# Altium project GECKO3.PRJPCB (part 3 of 4)

## Sheet jtag.SchDoc: JTAG and RS232 Connector
size A4; Organization: Berne University of Applied Science; Address1: School of Engineering and; Address2: Information Technology; Address3: Quellgasse 21; Address4: CH-2501 Biel; Revision: 1.0; SheetNumber: 17; SheetTotal: 19; ApprovedBy: zem1; Author: zac1
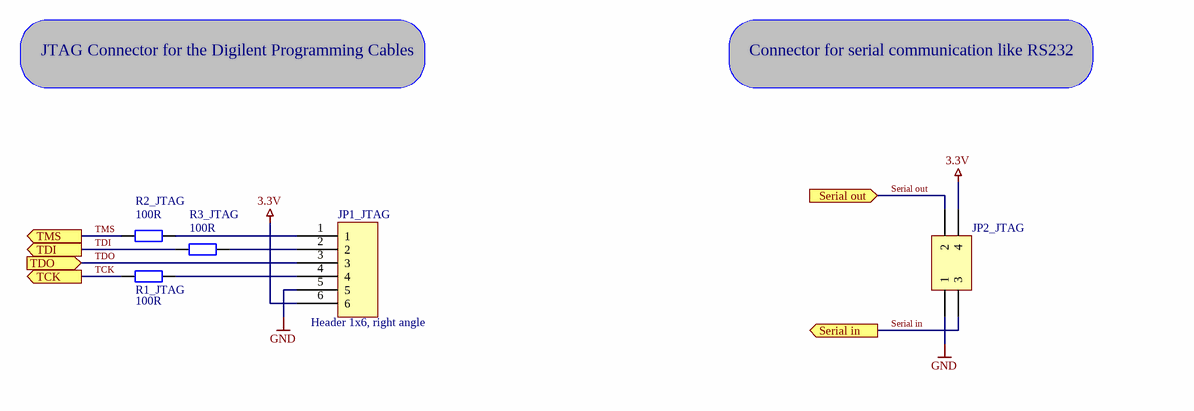
[diagram p8: jtag.SchDoc]

### Parts
JP1_JTAG  value Header 1x6, right angle  [HDR1X6H-90°]  (hidden comment: Header 6H)
JP2_JTAG  M22-2040205  [M22-2040205]  (value not drawn)
R1_JTAG  value 100R  [0402]  (hidden comment: Res2)
R2_JTAG  value 100R  [0402]  (hidden comment: Res2)
R3_JTAG  value 100R  [0402]  (hidden comment: Res2)

### Ports
Serial in (out), Serial out (in), TCK (out), TDI (out), TDO (in), TMS (out)

### Nets
3.3V: JP1_JTAG.6 JP2_JTAG.4
GND: JP1_JTAG.5 JP2_JTAG.1
SERIAL IN: JP2_JTAG.3 ; port Serial in
SERIAL OUT: JP2_JTAG.2 ; port Serial out
TCK: R1_JTAG.1 ; port TCK
TDI: R3_JTAG.1 ; port TDI
TDO: JP1_JTAG.3 ; port TDO
TMS: R2_JTAG.1 ; port TMS
NetJP1_JTAG_1: JP1_JTAG.1 R2_JTAG.2
NetJP1_JTAG_2: JP1_JTAG.2 R3_JTAG.2
NetJP1_JTAG_4: JP1_JTAG.4 R1_JTAG.2

### Notes on the sheet
- JTAG Connector for the Digilent Programming Cables
- Connector for serial communication like RS232
- Title:
- Size:
- Date:
- A4_L
- Author:
- Time:
- Revision:
- Sheet
- of
- File:

### Library data of the parts
JP1_JTAG = JTAG_CONNECTOR: Header, 6-Pin,  Right Angle; Manufacturer: Fischer; Part Number: SL1/53/36 Z; Currency: CHF; Packaging unit: 6; Prize: 2.69; Distributor Number: 122 201; RoHS: yes; Distributor: Distrelec
JP2_JTAG = M22-2040205: Manufacturer: HARWIN; Currency: CHF; Packaging unit: 1; Prize: 1.2; VALUE: M22-2040205; Part Number: M22-2040205; RoHS: yes; Distributor Number: 672 208; Distributor: Farnell
R1_JTAG R2_JTAG R3_JTAG = Res2: Resistor; Manufacturer: PHYCOMP; Part Number: 232270671001; Class I: Passive; Currency: CHF; Packaging unit: 50; Prize: 0.12; Published: 8-Jun-2000; Revision: July-2002: Re-released for DXP Platform.; Publisher: Altium Limited; Class II: Resistor; Distributor Number: 9239111; RoHS: yes; Distributor: Farnell

## Sheet i2c.SchDoc: I2C Devices
size A4; Organization: Berne University of Applied Science; Address1: School of Engineering and; Address2: Information Technology; Address3: Quellgasse 21; Address4: CH-2501 Biel; Revision: 1.0; SheetNumber: 15; SheetTotal: 19; ApprovedBy: zem1; Author: zac1
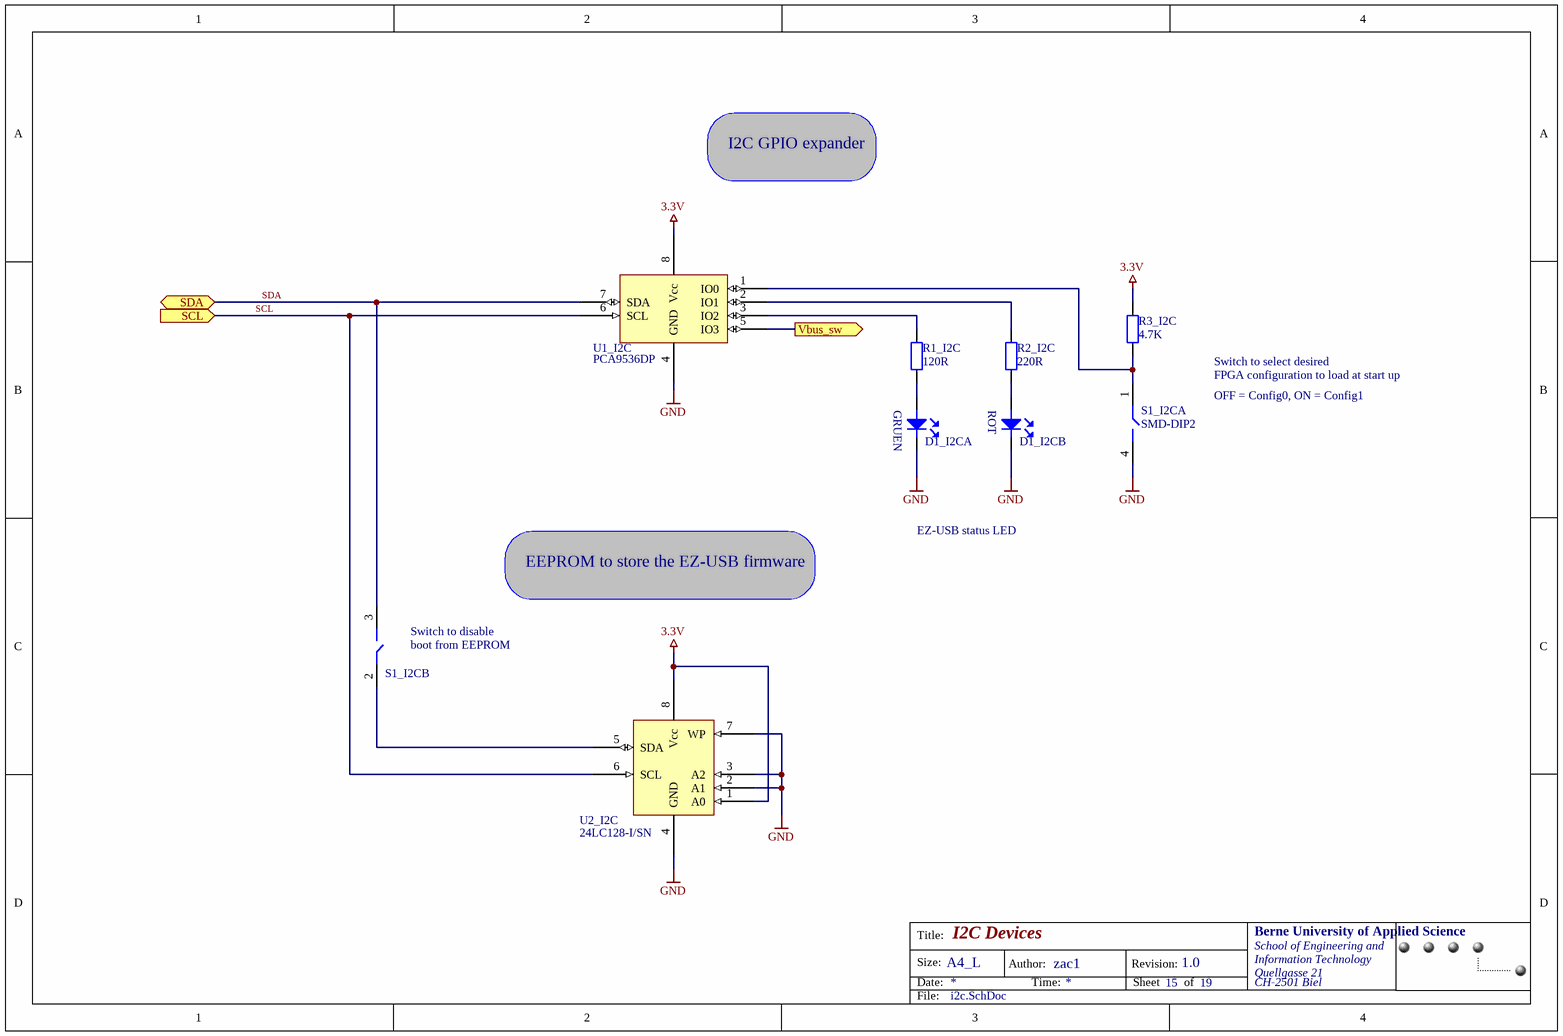
[diagram p9: i2c.SchDoc]

### Parts
D1_I2C  1211C-LED  [stan-led4]  (value not drawn)  (parts A,B of 2)
R1_I2C  value 120R  [0402]  (hidden comment: Res2)
R2_I2C  value 220R  [0402]  (hidden comment: Res2)
R3_I2C  value 4.7K  [0402]  (hidden comment: Res2)
S1_I2C  value SMD-DIP2  [MINIDIP2]  (hidden comment: SW-DIP2)  (parts A,B of 2)
U1_I2C  value PCA9536DP  [TSSO3X6-G8/X.3]  (hidden comment: PCA9536)
U2_I2C  24LC128-I/SN  [SO-G8]

### Ports
SCL (in), SDA (bidir), Vbus_sw (out)

### Nets
3.3V: R3_I2C.2 U1_I2C.8(Vcc) U2_I2C.1(A0) U2_I2C.8(Vcc)
GND: D1_I2C.2(K) D1_I2C.4(K) S1_I2C.4 U1_I2C.4(GND) U2_I2C.2(A1) U2_I2C.3(A2) U2_I2C.4(GND) U2_I2C.7(WP)
SCL: U1_I2C.6(SCL) U2_I2C.6(SCL) ; port SCL
SDA: S1_I2C.3 U1_I2C.7(SDA) ; port SDA
Vbus_sw: U1_I2C.5(IO3) ; port Vbus_sw
NetD1_I2C_1: D1_I2C.1(A) R2_I2C.1
NetD1_I2C_3: D1_I2C.3(A) R1_I2C.1
NetR1_I2C_2: R1_I2C.2 U1_I2C.3(IO2)
NetR2_I2C_2: R2_I2C.2 U1_I2C.2(IO1)
NetR3_I2C_1: R3_I2C.1 S1_I2C.1 U1_I2C.1(IO0)
NetS1_I2C_2: S1_I2C.2 U2_I2C.5(SDA)

### Notes on the sheet
- I2C GPIO expander
- Switch to select desired
- FPGA configuration to load at start up
- OFF = Config0, ON = Config1
- EEPROM to store the EZ-USB firmware
- EZ-USB status LED
- (near S1_I2C) Switch to disable
- (near S1_I2C) boot from EEPROM
- Title:
- Size:
- Date:
- A4_L
- Author:
- Time:
- Revision:
- Sheet
- of
- File:
- (in symbol 1211C-LED, part A) GRUEN
- (in symbol 1211C-LED, part B) ROT

### Library data of the parts
D1_I2C = 1211C-LED: Stanley 1211C Bi-Color Ultra Compact SMT LED; Value: BRBG1211C; Currency: CHF; Packaging unit: 1; Prize: 0.86; Distributor Number: 253183; Manufacturer: Stanley; Part Number: BRBG1211C; RoHS: yes; Distributor: Distrelec
R1_I2C = Res2: Resistor; Manufacturer: PHYCOMP; Part Number: 232270671201; Class I: Passive; Currency: CHF; Packaging unit: 50; Prize: 0.12; Published: 8-Jun-2000; Revision: July-2002: Re-released for DXP Platform.; Publisher: Altium Limited; Class II: Resistor; Distributor Number: 9239120; RoHS: yes; Distributor: Farnell
R2_I2C = Res2: Resistor; Manufacturer: PHYCOMP; Part Number: 232270672201; Class I: Passive; Currency: CHF; Packaging unit: 50; Prize: 0.12; Published: 8-Jun-2000; Revision: July-2002: Re-released for DXP Platform.; Publisher: Altium Limited; Class II: Resistor; Distributor Number: 9239154; RoHS: yes; Distributor: Farnell
R3_I2C = Res2: as R1_FP1 on sheet fpga1; Published: 8-Jun-2000; Revision: July-2002: Re-released for DXP Platform.; Publisher: Altium Limited; Class II: Resistor; Distributor Number: 9239316; RoHS: yes; Distributor: Farnell
S1_I2C = SW-DIP2: Manufacturer: TYCO; Part Number: GDH02S; Currency: CHF; Packaging unit: 1; Prize: 7.1; Distributor Number: 1123952; RoHS: yes; Distributor: Farnell
U1_I2C = PCA9536: 4-bit I2C I/O Port; Manufacturer: TI; Part Number: PCA9536DGKR; Currency: CHF; Packaging unit: 1; Prize: 2.45; lead time: 2 Weeks; Distributor Number: 1310 217; RoHS: yes; Distributor: Farnell
U2_I2C = 24LC128-I/SN: Manufacturer: Microchip; Currency: CHF; lead time: 6 Weeks; Packaging unit: 100; Prize: 0.96; Value: 24LC128-I/SN; Distributor Number: 24LC128ISN; Part Number: 24LC128-I/SN; RoHS: yes; Distributor: Silica

## Sheet io-bus.SchDoc: GECKO3 Power and I/O Bus
size A3; Organization: Berne University of Applied Science; Address1: School of Engineering and; Address2: Information Technology; Address3: Quellgasse 21; Address4: CH-2501 Biel; Revision: 1.0; SheetNumber: 7; SheetTotal: 19; ApprovedBy: zem1; Author: zac1
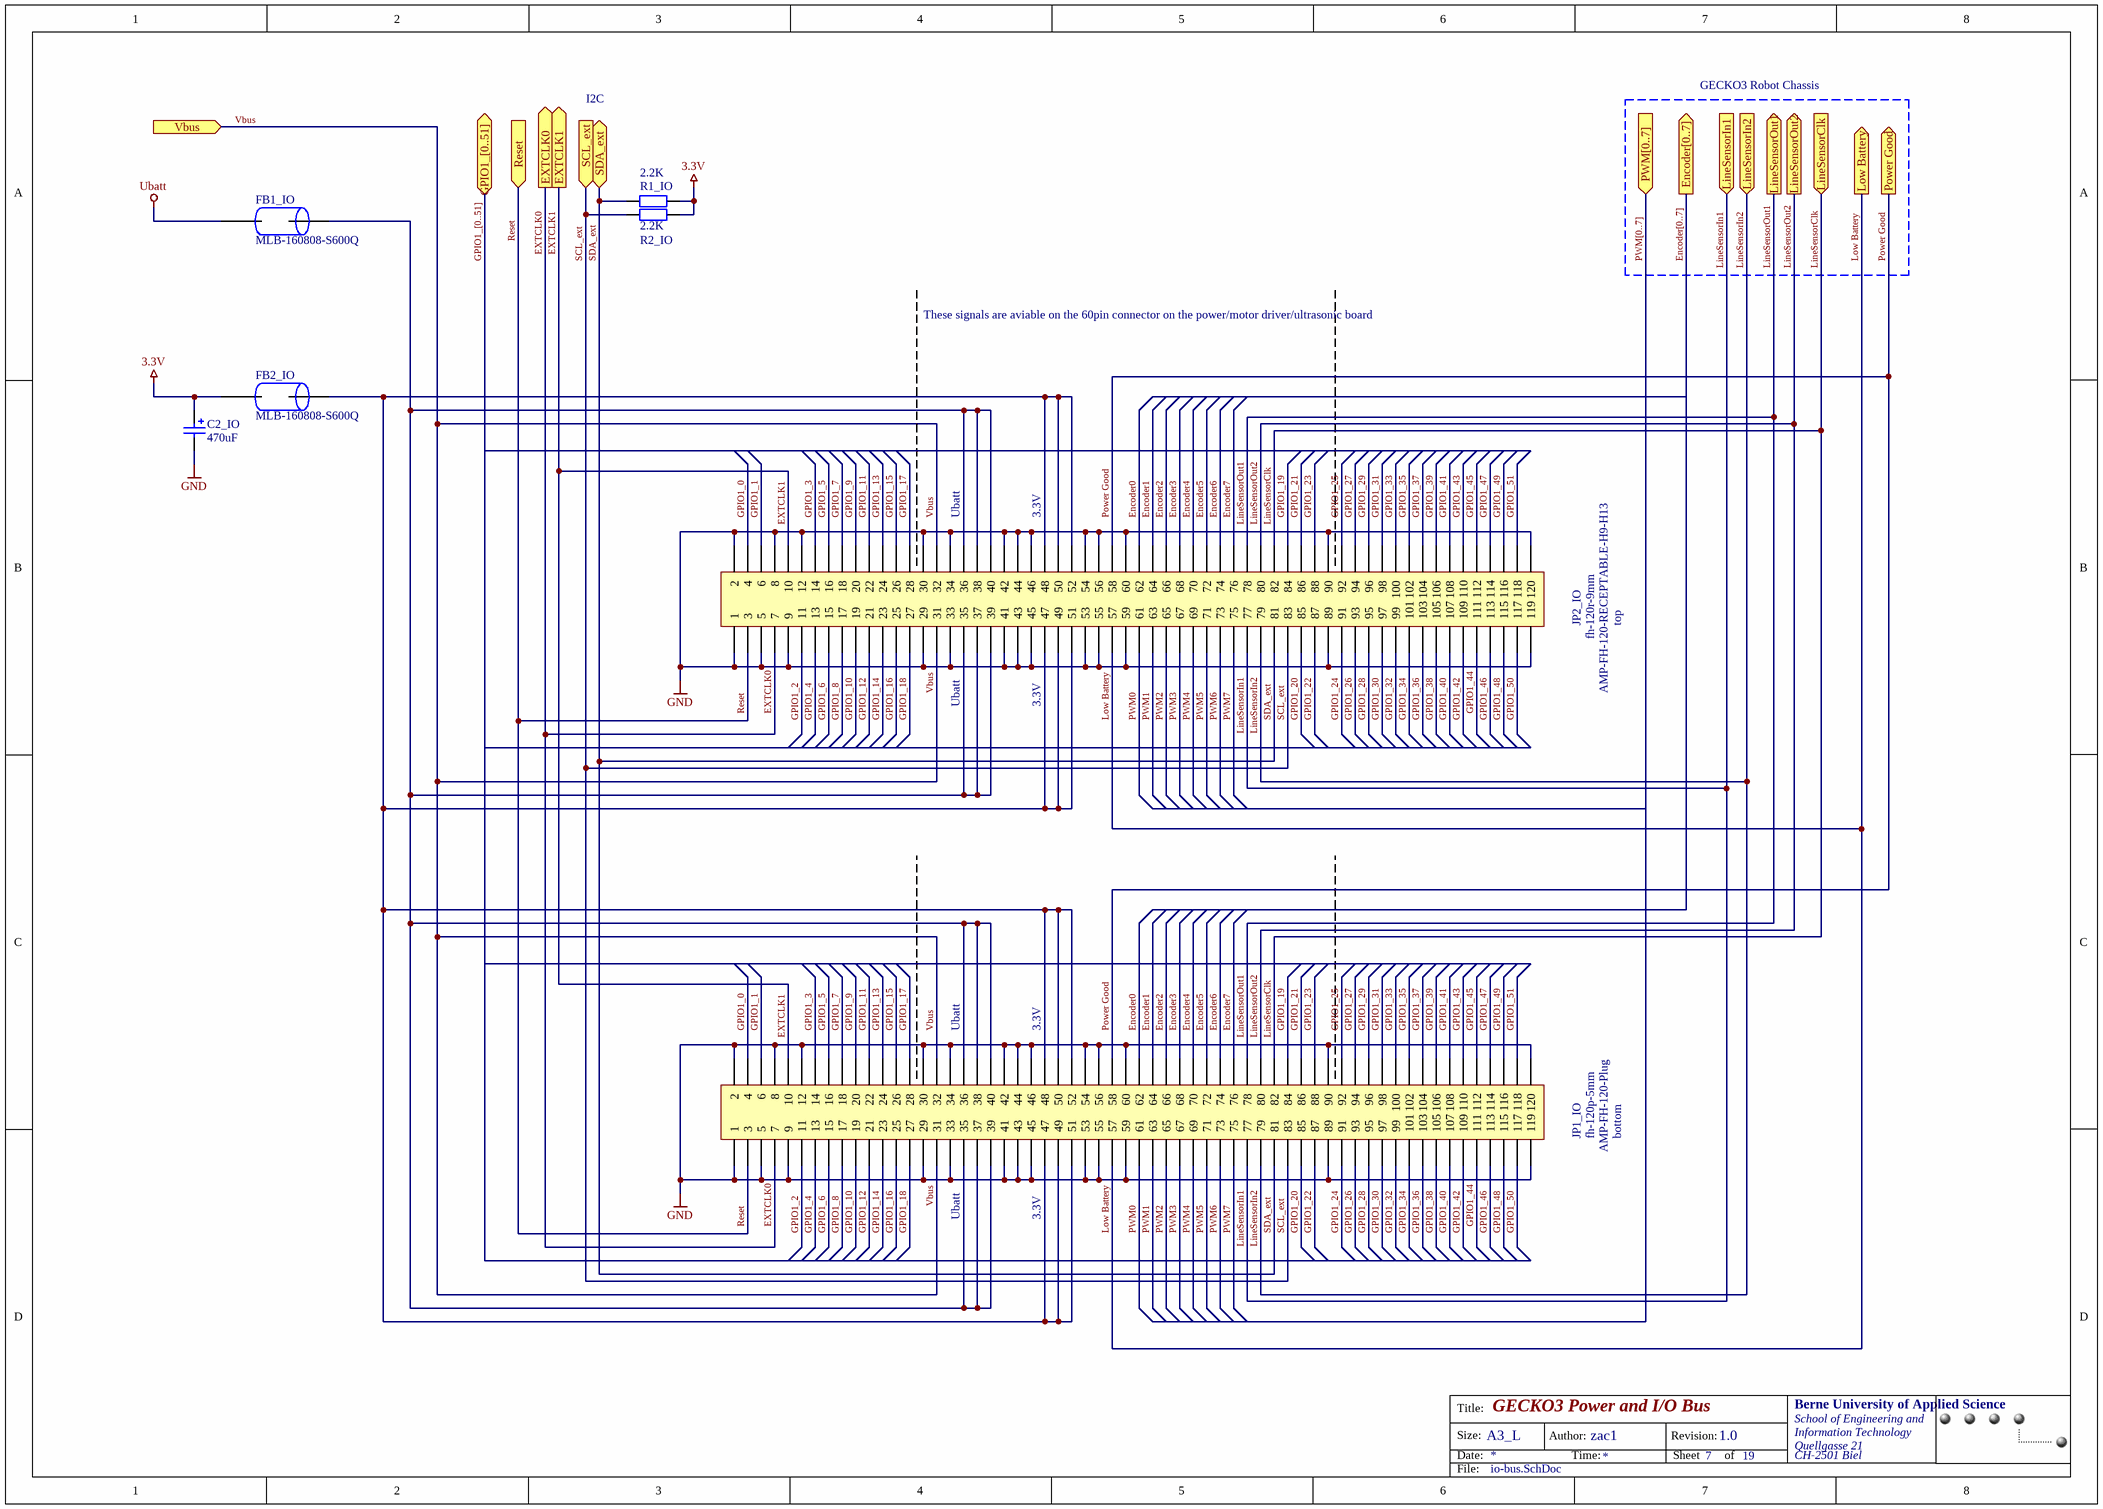
[diagram p10: io-bus.SchDoc]

### Parts
C2_IO  value 470uF  [D]  (hidden comment: Cap Pol3)
FB1_IO  value MLB-160808-S600Q  [0603]  (hidden comment: FERRITE-BEAD)
FB2_IO  value MLB-160808-S600Q  [0603]  (hidden comment: FERRITE-BEAD)
JP1_IO  AMP-FH-120-Plug  value fh-120p-5mm  Comment_1: bottom  [amp_FH_.8mm_120pin_plug]
JP2_IO  AMP-FH-120-RECEPTABLE-H9-H13  value fh-120r-9mm  Comment_1: top  [amp_FH_.8mm_120pin_r_H9_H13]
R1_IO  value 2.2K  [0402]  (hidden comment: Res2)
R2_IO  value 2.2K  [0402]  (hidden comment: Res2)

### Ports
Encoder[0..7] (out), EXTCLK0 (out), EXTCLK1 (out), GPIO1_[0..51] (bidir), LineSensorClk (in), LineSensorIn1 (in), LineSensorIn2 (in), LineSensorOut1 (out), LineSensorOut2 (out), Low Battery (out), Power Good (out), PWM[0..7] (in), Reset (in), SCL_ext (in), SDA_ext (bidir), Vbus (in)

### Nets
3.3V: C2_IO.1 FB2_IO.1 R1_IO.2 R2_IO.2
GND: C2_IO.2 JP1_IO.1 JP1_IO.2 JP1_IO.5 JP1_IO.8 JP1_IO.9 JP1_IO.12 JP1_IO.29 JP1_IO.30 JP1_IO.33 JP1_IO.34 JP1_IO.41 JP1_IO.42 JP1_IO.43 JP1_IO.44 JP1_IO.45 JP1_IO.46 JP1_IO.53 JP1_IO.54 JP1_IO.55 JP1_IO.56 JP1_IO.59 JP1_IO.60 JP1_IO.89 JP1_IO.90 JP1_IO.119 JP1_IO.120 JP2_IO.1 JP2_IO.2 JP2_IO.5 JP2_IO.8 JP2_IO.9 JP2_IO.12 JP2_IO.29 JP2_IO.30 JP2_IO.33 JP2_IO.34 JP2_IO.41 JP2_IO.42 JP2_IO.43 JP2_IO.44 JP2_IO.45 JP2_IO.46 JP2_IO.53 JP2_IO.54 JP2_IO.55 JP2_IO.56 JP2_IO.59 JP2_IO.60 JP2_IO.89 JP2_IO.90 JP2_IO.119 JP2_IO.120
Ubatt: FB1_IO.1
ENCODER0: JP1_IO.62 JP2_IO.62
ENCODER1: JP1_IO.64 JP2_IO.64
ENCODER2: JP1_IO.66 JP2_IO.66
ENCODER3: JP1_IO.68 JP2_IO.68
ENCODER4: JP1_IO.70 JP2_IO.70
ENCODER5: JP1_IO.72 JP2_IO.72
ENCODER6: JP1_IO.74 JP2_IO.74
ENCODER7: JP1_IO.76 JP2_IO.76
EXTCLK0: JP1_IO.7 JP2_IO.7 ; port EXTCLK0
EXTCLK1: JP1_IO.10 JP2_IO.10 ; port EXTCLK1
GPIO1_0: JP1_IO.4 JP2_IO.4
GPIO1_1: JP1_IO.6 JP2_IO.6
GPIO1_2: JP1_IO.11 JP2_IO.11
GPIO1_3: JP1_IO.14 JP2_IO.14
GPIO1_4: JP1_IO.13 JP2_IO.13
GPIO1_5: JP1_IO.16 JP2_IO.16
GPIO1_6: JP1_IO.15 JP2_IO.15
GPIO1_7: JP1_IO.18 JP2_IO.18
GPIO1_8: JP1_IO.17 JP2_IO.17
GPIO1_9: JP1_IO.20 JP2_IO.20
GPIO1_10: JP1_IO.19 JP2_IO.19
GPIO1_11: JP1_IO.22 JP2_IO.22
GPIO1_12: JP1_IO.21 JP2_IO.21
GPIO1_13: JP1_IO.24 JP2_IO.24
GPIO1_14: JP1_IO.23 JP2_IO.23
GPIO1_15: JP1_IO.26 JP2_IO.26
GPIO1_16: JP1_IO.25 JP2_IO.25
GPIO1_17: JP1_IO.28 JP2_IO.28
GPIO1_18: JP1_IO.27 JP2_IO.27
GPIO1_19: JP1_IO.84 JP2_IO.84
GPIO1_20: JP1_IO.85 JP2_IO.85
GPIO1_21: JP1_IO.86 JP2_IO.86
GPIO1_22: JP1_IO.87 JP2_IO.87
GPIO1_23: JP1_IO.88 JP2_IO.88
GPIO1_24: JP1_IO.91 JP2_IO.91
GPIO1_25: JP1_IO.92 JP2_IO.92
GPIO1_26: JP1_IO.93 JP2_IO.93
GPIO1_27: JP1_IO.94 JP2_IO.94
GPIO1_28: JP1_IO.95 JP2_IO.95
GPIO1_29: JP1_IO.96 JP2_IO.96
GPIO1_30: JP1_IO.97 JP2_IO.97
GPIO1_31: JP1_IO.98 JP2_IO.98
GPIO1_32: JP1_IO.99 JP2_IO.99
GPIO1_33: JP1_IO.100 JP2_IO.100
GPIO1_34: JP1_IO.101 JP2_IO.101
GPIO1_35: JP1_IO.102 JP2_IO.102
GPIO1_36: JP1_IO.103 JP2_IO.103
GPIO1_37: JP1_IO.104 JP2_IO.104
GPIO1_38: JP1_IO.105 JP2_IO.105
GPIO1_39: JP1_IO.106 JP2_IO.106
GPIO1_40: JP1_IO.107 JP2_IO.107
GPIO1_41: JP1_IO.108 JP2_IO.108
GPIO1_42: JP1_IO.109 JP2_IO.109
GPIO1_43: JP1_IO.110 JP2_IO.110
GPIO1_44: JP1_IO.111 JP2_IO.111
GPIO1_45: JP1_IO.112 JP2_IO.112
GPIO1_46: JP1_IO.113 JP2_IO.113
GPIO1_47: JP1_IO.114 JP2_IO.114
GPIO1_48: JP1_IO.115 JP2_IO.115
GPIO1_49: JP1_IO.116 JP2_IO.116
GPIO1_50: JP1_IO.117 JP2_IO.117
GPIO1_51: JP1_IO.118 JP2_IO.118
LINESENSORCLK: JP1_IO.82 JP2_IO.82 ; port LineSensorClk
LINESENSORIN1: JP1_IO.77 JP2_IO.77 ; port LineSensorIn1
LINESENSORIN2: JP1_IO.79 JP2_IO.79 ; port LineSensorIn2
LINESENSOROUT1: JP1_IO.78 JP2_IO.78 ; port LineSensorOut1
LINESENSOROUT2: JP1_IO.80 JP2_IO.80 ; port LineSensorOut2
LOW BATTERY: JP1_IO.57 JP2_IO.57 ; port Low Battery
POWER GOOD: JP1_IO.58 JP2_IO.58 ; port Power Good
PWM0: JP1_IO.61 JP2_IO.61
PWM1: JP1_IO.63 JP2_IO.63
PWM2: JP1_IO.65 JP2_IO.65
PWM3: JP1_IO.67 JP2_IO.67
PWM4: JP1_IO.69 JP2_IO.69
PWM5: JP1_IO.71 JP2_IO.71
PWM6: JP1_IO.73 JP2_IO.73
PWM7: JP1_IO.75 JP2_IO.75
RESET: JP1_IO.3 JP2_IO.3 ; port Reset
SCL_EXT: JP1_IO.83 JP2_IO.83 R2_IO.1 ; port SCL_ext
SDA_EXT: JP1_IO.81 JP2_IO.81 R1_IO.1 ; port SDA_ext
Vbus: JP1_IO.31 JP1_IO.32 JP2_IO.31 JP2_IO.32 ; port Vbus
NetFB1_IO_2: FB1_IO.2 JP1_IO.35 JP1_IO.36 JP1_IO.37 JP1_IO.38 JP1_IO.39 JP1_IO.40 JP2_IO.35 JP2_IO.36 JP2_IO.37 JP2_IO.38 JP2_IO.39 JP2_IO.40
NetFB2_IO_2: FB2_IO.2 JP1_IO.47 JP1_IO.48 JP1_IO.49 JP1_IO.50 JP1_IO.51 JP1_IO.52 JP2_IO.47 JP2_IO.48 JP2_IO.49 JP2_IO.50 JP2_IO.51 JP2_IO.52

### Buses and harness runs
bus Encoder[0..7] = port Encoder[0..7]
bus GPIO1_[0..51] = port GPIO1_[0..51]
bus PWM[0..7] = port PWM[0..7]

### Notes on the sheet
- I2C
- GECKO3 Robot Chassis
- These signals are aviable on the 60pin connector on the power/motor driver/ultrasonic board
- Ubatt
- 3.3V
- (near JP2_IO) Ubatt
- (near JP1_IO) Ubatt
- Title:
- Size:
- Date:
- A3_L
- Author:
- Time:
- Revision:
- Sheet
- of
- File:

### Library data of the parts
C2_IO = Cap Pol3: Polarized Capacitor (Surface Mount); Manufacturer: Kemet; Part Number: B45196-H2477-K509; Class I: Passive; Currency: CHF; Packaging unit: 1; Published: 8-Jun-2000; Revision: July-2002: Re-released for DXP Platform.; Publisher: Altium Limited; Class II: Capacitor; Distributor Number: 811 024; RoHS: yes; Distributor: Distrelec; Price: 3.77
FB1_IO FB2_IO = FERRITE-BEAD: Manufacturer: Kitagawa; Currency: CHF; Packaging unit: 5; Distributor Number: 330 131; Part Number: MLB-160808-S600Q; RoHS: yes; Distributor: Distrelec; Price: 0.75
JP1_IO = AMP-FH-120-Plug: AMP Free Height System, 0.8mm, 120 Pin, Plug; Part Number: 5177984-5; Currency: CHF; Packaging unit: 1; Manufacturer: AMP; RoHS: yes; Distributor: Farnell; Distributor Number: 1098 339; Price: 7.95
JP2_IO = AMP-FH-120-RECEPTABLE-H9-H13: AMP Free Height System, 0.8mm, 120 Pin, 9 or 13mm Height, Receptable; Part Number: 5-5179009-5; Currency: CHF; Packaging unit: 1; Manufacturer: AMP; RoHS: yes; Distributor: Farnell; Distributor Number: 1098 355; Price: 6.85
R1_IO R2_IO = Res2: Resistor; Manufacturer: PHYCOMP; Part Number: 232270672202; Class I: Passive; Currency: CHF; Packaging unit: 50; Published: 8-Jun-2000; Revision: July-2002: Re-released for DXP Platform.; Publisher: Altium Limited; Class II: Resistor; Distributor Number: 9239 278; RoHS: yes; Distributor: Farnell; Price: 0.12

## Sheet io-bus2.SchDoc: GECKO3 System and I/O Bus
size A4; Organization: Berne University of Applied Science; Address1: School of Engineering and; Address2: Information Technology; Address3: Quellgasse 21; Address4: CH-2501 Biel; Revision: 1.0; SheetNumber: 8; SheetTotal: 19; ApprovedBy: zem1; Author: zac1
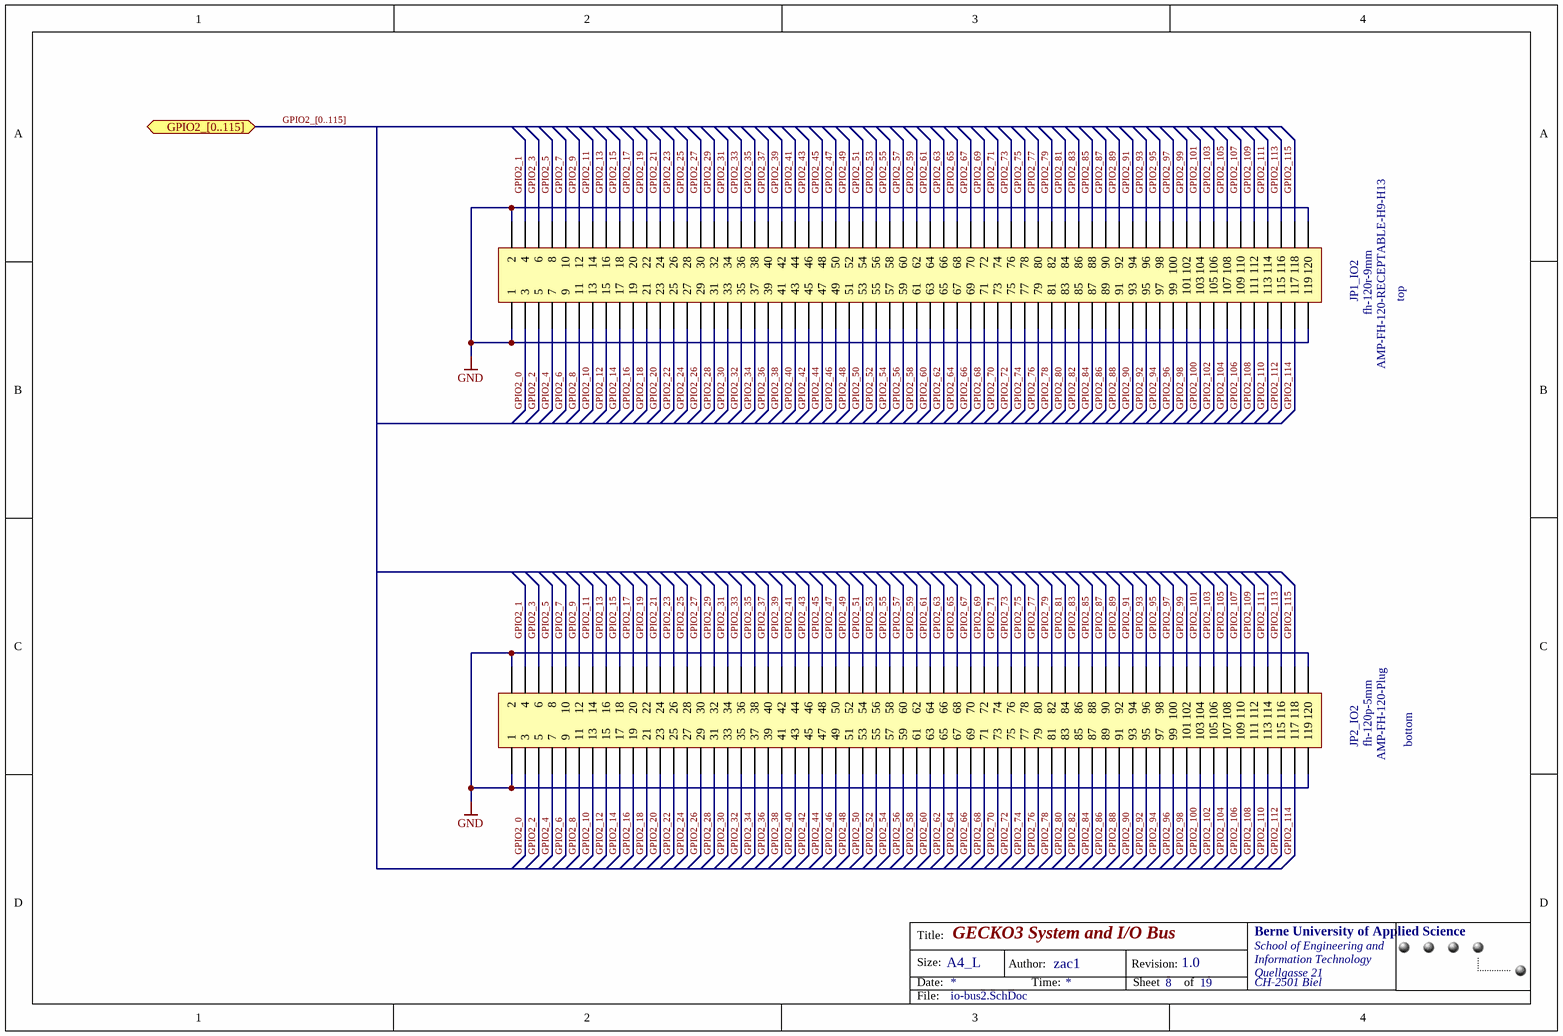
[diagram p11: io-bus2.SchDoc]

### Parts
JP1_IO2  AMP-FH-120-RECEPTABLE-H9-H13  value fh-120r-9mm  Comment_1: top  [amp_FH_.8mm_120pin_r_H9_H13]
JP2_IO2  AMP-FH-120-Plug  value fh-120p-5mm  Comment_1: bottom  [amp_FH_.8mm_120pin_plug]

### Ports
GPIO2_[0..115] (bidir)

### Nets
GND: JP1_IO2.1 JP1_IO2.2 JP1_IO2.119 JP1_IO2.120 JP2_IO2.1 JP2_IO2.2 JP2_IO2.119 JP2_IO2.120
GPIO2_0: JP1_IO2.3 JP2_IO2.3
GPIO2_1: JP1_IO2.4 JP2_IO2.4
GPIO2_2: JP1_IO2.5 JP2_IO2.5
GPIO2_3: JP1_IO2.6 JP2_IO2.6
GPIO2_4: JP1_IO2.7 JP2_IO2.7
GPIO2_5: JP1_IO2.8 JP2_IO2.8
GPIO2_6: JP1_IO2.9 JP2_IO2.9
GPIO2_7: JP1_IO2.10 JP2_IO2.10
GPIO2_8: JP1_IO2.11 JP2_IO2.11
GPIO2_9: JP1_IO2.12 JP2_IO2.12
GPIO2_10: JP1_IO2.13 JP2_IO2.13
GPIO2_11: JP1_IO2.14 JP2_IO2.14
GPIO2_12: JP1_IO2.15 JP2_IO2.15
GPIO2_13: JP1_IO2.16 JP2_IO2.16
GPIO2_14: JP1_IO2.17 JP2_IO2.17
GPIO2_15: JP1_IO2.18 JP2_IO2.18
GPIO2_16: JP1_IO2.19 JP2_IO2.19
GPIO2_17: JP1_IO2.20 JP2_IO2.20
GPIO2_18: JP1_IO2.21 JP2_IO2.21
GPIO2_19: JP1_IO2.22 JP2_IO2.22
GPIO2_20: JP1_IO2.23 JP2_IO2.23
GPIO2_21: JP1_IO2.24 JP2_IO2.24
GPIO2_22: JP1_IO2.25 JP2_IO2.25
GPIO2_23: JP1_IO2.26 JP2_IO2.26
GPIO2_24: JP1_IO2.27 JP2_IO2.27
GPIO2_25: JP1_IO2.28 JP2_IO2.28
GPIO2_26: JP1_IO2.29 JP2_IO2.29
GPIO2_27: JP1_IO2.30 JP2_IO2.30
GPIO2_28: JP1_IO2.31 JP2_IO2.31
GPIO2_29: JP1_IO2.32 JP2_IO2.32
GPIO2_30: JP1_IO2.33 JP2_IO2.33
GPIO2_31: JP1_IO2.34 JP2_IO2.34
GPIO2_32: JP1_IO2.35 JP2_IO2.35
GPIO2_33: JP1_IO2.36 JP2_IO2.36
GPIO2_34: JP1_IO2.37 JP2_IO2.37
GPIO2_35: JP1_IO2.38 JP2_IO2.38
GPIO2_36: JP1_IO2.39 JP2_IO2.39
GPIO2_37: JP1_IO2.40 JP2_IO2.40
GPIO2_38: JP1_IO2.41 JP2_IO2.41
GPIO2_39: JP1_IO2.42 JP2_IO2.42
GPIO2_40: JP1_IO2.43 JP2_IO2.43
GPIO2_41: JP1_IO2.44 JP2_IO2.44
GPIO2_42: JP1_IO2.45 JP2_IO2.45
GPIO2_43: JP1_IO2.46 JP2_IO2.46
GPIO2_44: JP1_IO2.47 JP2_IO2.47
GPIO2_45: JP1_IO2.48 JP2_IO2.48
GPIO2_46: JP1_IO2.49 JP2_IO2.49
GPIO2_47: JP1_IO2.50 JP2_IO2.50
GPIO2_48: JP1_IO2.51 JP2_IO2.51
GPIO2_49: JP1_IO2.52 JP2_IO2.52
GPIO2_50: JP1_IO2.53 JP2_IO2.53
GPIO2_51: JP1_IO2.54 JP2_IO2.54
GPIO2_52: JP1_IO2.55 JP2_IO2.55
GPIO2_53: JP1_IO2.56 JP2_IO2.56
GPIO2_54: JP1_IO2.57 JP2_IO2.57
GPIO2_55: JP1_IO2.58 JP2_IO2.58
GPIO2_56: JP1_IO2.59 JP2_IO2.59
GPIO2_57: JP1_IO2.60 JP2_IO2.60
GPIO2_58: JP1_IO2.61 JP2_IO2.61
GPIO2_59: JP1_IO2.62 JP2_IO2.62
GPIO2_60: JP1_IO2.63 JP2_IO2.63
GPIO2_61: JP1_IO2.64 JP2_IO2.64
GPIO2_62: JP1_IO2.65 JP2_IO2.65
GPIO2_63: JP1_IO2.66 JP2_IO2.66
GPIO2_64: JP1_IO2.67 JP2_IO2.67
GPIO2_65: JP1_IO2.68 JP2_IO2.68
GPIO2_66: JP1_IO2.69 JP2_IO2.69
GPIO2_67: JP1_IO2.70 JP2_IO2.70
GPIO2_68: JP1_IO2.71 JP2_IO2.71
GPIO2_69: JP1_IO2.72 JP2_IO2.72
GPIO2_70: JP1_IO2.73 JP2_IO2.73
GPIO2_71: JP1_IO2.74 JP2_IO2.74
GPIO2_72: JP1_IO2.75 JP2_IO2.75
GPIO2_73: JP1_IO2.76 JP2_IO2.76
GPIO2_74: JP1_IO2.77 JP2_IO2.77
GPIO2_75: JP1_IO2.78 JP2_IO2.78
GPIO2_76: JP1_IO2.79 JP2_IO2.79
GPIO2_77: JP1_IO2.80 JP2_IO2.80
GPIO2_78: JP1_IO2.81 JP2_IO2.81
GPIO2_79: JP1_IO2.82 JP2_IO2.82
GPIO2_80: JP1_IO2.83 JP2_IO2.83
GPIO2_81: JP1_IO2.84 JP2_IO2.84
GPIO2_82: JP1_IO2.85 JP2_IO2.85
GPIO2_83: JP1_IO2.86 JP2_IO2.86
GPIO2_84: JP1_IO2.87 JP2_IO2.87
GPIO2_85: JP1_IO2.88 JP2_IO2.88
GPIO2_86: JP1_IO2.89 JP2_IO2.89
GPIO2_87: JP1_IO2.90 JP2_IO2.90
GPIO2_88: JP1_IO2.91 JP2_IO2.91
GPIO2_89: JP1_IO2.92 JP2_IO2.92
GPIO2_90: JP1_IO2.93 JP2_IO2.93
GPIO2_91: JP1_IO2.94 JP2_IO2.94
GPIO2_92: JP1_IO2.95 JP2_IO2.95
GPIO2_93: JP1_IO2.96 JP2_IO2.96
GPIO2_94: JP1_IO2.97 JP2_IO2.97
GPIO2_95: JP1_IO2.98 JP2_IO2.98
GPIO2_96: JP1_IO2.99 JP2_IO2.99
GPIO2_97: JP1_IO2.100 JP2_IO2.100
GPIO2_98: JP1_IO2.101 JP2_IO2.101
GPIO2_99: JP1_IO2.102 JP2_IO2.102
GPIO2_100: JP1_IO2.103 JP2_IO2.103
GPIO2_101: JP1_IO2.104 JP2_IO2.104
GPIO2_102: JP1_IO2.105 JP2_IO2.105
GPIO2_103: JP1_IO2.106 JP2_IO2.106
GPIO2_104: JP1_IO2.107 JP2_IO2.107
GPIO2_105: JP1_IO2.108 JP2_IO2.108
GPIO2_106: JP1_IO2.109 JP2_IO2.109
GPIO2_107: JP1_IO2.110 JP2_IO2.110
GPIO2_108: JP1_IO2.111 JP2_IO2.111
GPIO2_109: JP1_IO2.112 JP2_IO2.112
GPIO2_110: JP1_IO2.113 JP2_IO2.113
GPIO2_111: JP1_IO2.114 JP2_IO2.114
GPIO2_112: JP1_IO2.115 JP2_IO2.115
GPIO2_113: JP1_IO2.116 JP2_IO2.116
GPIO2_114: JP1_IO2.117 JP2_IO2.117
GPIO2_115: JP1_IO2.118 JP2_IO2.118

### Buses and harness runs
bus GPIO2_[0..115] = port GPIO2_[0..115]

### Notes on the sheet
- Title:
- Size:
- Date:
- A4_L
- Author:
- Time:
- Revision:
- Sheet
- of
- File:

### Library data of the parts
JP1_IO2 = AMP-FH-120-RECEPTABLE-H9-H13: as JP2_IO on sheet io-bus; Manufacturer: AMP; RoHS: yes; Distributor: Farnell; Distributor Number: 1098 355; Price: 6.85
JP2_IO2 = AMP-FH-120-Plug: as JP1_IO on sheet io-bus; Manufacturer: AMP; RoHS: yes; Distributor: Farnell; Distributor Number: 1098 339; Price: 7.95

## Sheet switches.SchDoc: Switches and LEDs
size A4; Organization: Berne University of Applied Science; Address1: School of Engineering and; Address2: Information Technology; Address3: Quellgasse 21; Address4: CH-2501 Biel; Revision: 1.0; SheetNumber: 12; SheetTotal: 19; ApprovedBy: zem1; Author: zac1
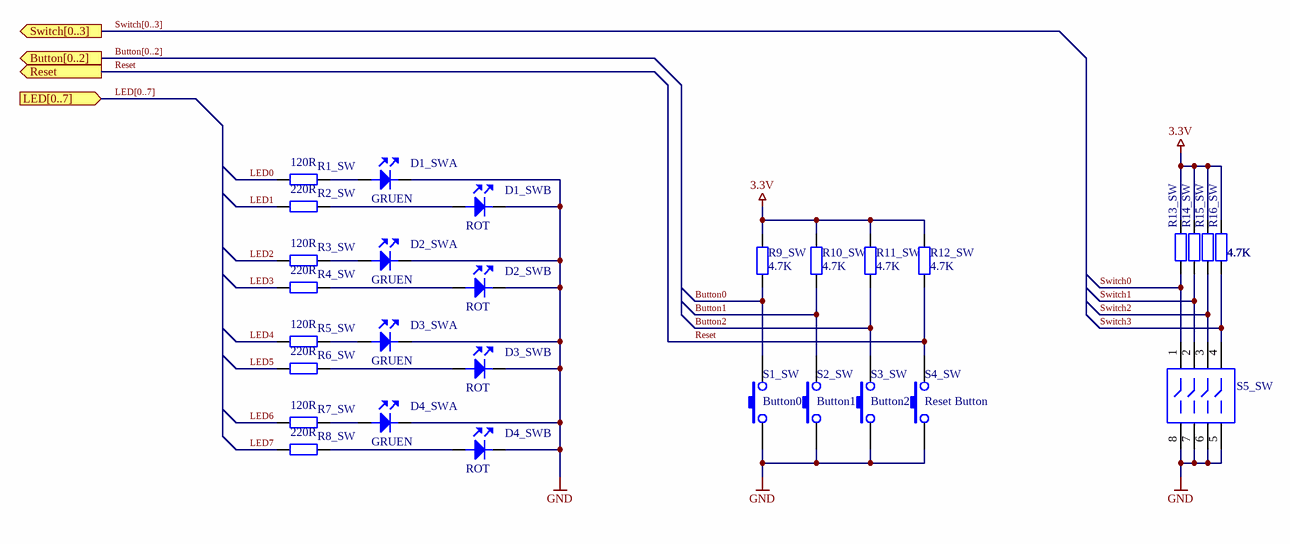
[diagram p12: switches.SchDoc]

### Parts
D1_SW  1211C-LED  [stan-led4]  (value not drawn)  (parts A,B of 2)
D2_SW  1211C-LED  [stan-led4]  (value not drawn)  (parts A,B of 2)
D3_SW  1211C-LED  [stan-led4]  (value not drawn)  (parts A,B of 2)
D4_SW  1211C-LED  [stan-led4]  (value not drawn)  (parts A,B of 2)
R1_SW  value 120R  [0402]  (hidden comment: Res2)
R2_SW  value 220R  [0402]  (hidden comment: Res2)
R3_SW  value 120R  [0402]  (hidden comment: Res2)
R4_SW  value 220R  [0402]  (hidden comment: Res2)
R5_SW  value 120R  [0402]  (hidden comment: Res2)
R6_SW  value 220R  [0402]  (hidden comment: Res2)
R7_SW  value 120R  [0402]  (hidden comment: Res2)
R8_SW  value 220R  [0402]  (hidden comment: Res2)
R9_SW  value 4.7K  [0402]  (hidden comment: Res2)
R10_SW  value 4.7K  [0402]  (hidden comment: Res2)
R11_SW  value 4.7K  [0402]  (hidden comment: Res2)
R12_SW  value 4.7K  [0402]  (hidden comment: Res2)
R13_SW  value 4.7K  [0402]  (hidden comment: Res2)
R14_SW  value 4.7K  [0402]  (hidden comment: Res2)
R15_SW  value 4.7K  [0402]  (hidden comment: Res2)
R16_SW  value 4.7K  [0402]  (hidden comment: Res2)
S1_SW  Button0  [FSM]
S2_SW  Button1  [FSM]
S3_SW  Button2  [FSM]
S4_SW  Reset Button  [FSM]
S5_SW  SW-DIP4  [DIP4]  (value not drawn)

### Ports
Button[0..2] (out), LED[0..7] (in), Reset (out), Switch[0..3] (out)

### Nets
3.3V: R9_SW.1 R10_SW.1 R11_SW.1 R12_SW.1 R13_SW.2 R14_SW.2 R15_SW.2 R16_SW.2
GND: D1_SW.2(K) D1_SW.4(K) D2_SW.2(K) D2_SW.4(K) D3_SW.2(K) D3_SW.4(K) D4_SW.2(K) D4_SW.4(K) S1_SW.2 S2_SW.2 S3_SW.2 S4_SW.1 S5_SW.5 S5_SW.6 S5_SW.7 S5_SW.8
BUTTON0: R9_SW.2 S1_SW.1
BUTTON1: R10_SW.2 S2_SW.1
BUTTON2: R11_SW.2 S3_SW.1
LED0: R1_SW.2
LED1: R2_SW.2
LED2: R3_SW.2
LED3: R4_SW.2
LED4: R5_SW.2
LED5: R6_SW.2
LED6: R7_SW.2
LED7: R8_SW.2
RESET: R12_SW.2 S4_SW.2 ; port Reset
SWITCH0: R13_SW.1 S5_SW.1
SWITCH1: R14_SW.1 S5_SW.2
SWITCH2: R15_SW.1 S5_SW.3
SWITCH3: R16_SW.1 S5_SW.4
NetD1_SW_1: D1_SW.1(A) R2_SW.1
NetD1_SW_3: D1_SW.3(A) R1_SW.1
NetD2_SW_1: D2_SW.1(A) R4_SW.1
NetD2_SW_3: D2_SW.3(A) R3_SW.1
NetD3_SW_1: D3_SW.1(A) R6_SW.1
NetD3_SW_3: D3_SW.3(A) R5_SW.1
NetD4_SW_1: D4_SW.1(A) R8_SW.1
NetD4_SW_3: D4_SW.3(A) R7_SW.1

### Buses and harness runs
bus Button[0..2] = port Button[0..2]
bus LED[0..7] = port LED[0..7]
bus Switch[0..3] = port Switch[0..3]

### Notes on the sheet
- Title:
- Size:
- Date:
- A4_L
- Author:
- Time:
- Revision:
- Sheet
- of
- File:
- (in symbol 1211C-LED, part A) GRUEN
- (in symbol 1211C-LED, part B) ROT

### Library data of the parts
D1_SW D2_SW D3_SW D4_SW = 1211C-LED: as D1_I2C on sheet i2c; Distributor Number: 253183; Manufacturer: Stanley; Part Number: BRBG1211C; RoHS: yes; Distributor: Distrelec
R1_SW R3_SW R5_SW R7_SW = Res2: as R1_I2C on sheet i2c; Published: 8-Jun-2000; Revision: July-2002: Re-released for DXP Platform.; Publisher: Altium Limited; Class II: Resistor; Distributor Number: 9239120; RoHS: yes; Distributor: Farnell
R2_SW R4_SW R6_SW R8_SW = Res2: as R2_I2C on sheet i2c; Published: 8-Jun-2000; Revision: July-2002: Re-released for DXP Platform.; Publisher: Altium Limited; Class II: Resistor; Distributor Number: 9239154; RoHS: yes; Distributor: Farnell
R9_SW R10_SW R11_SW R12_SW R13_SW R14_SW R15_SW R16_SW = Res2: as R1_FP1 on sheet fpga1; Published: 8-Jun-2000; Revision: July-2002: Re-released for DXP Platform.; Publisher: Altium Limited; Class II: Resistor; Distributor Number: 9239316; RoHS: yes; Distributor: Farnell
S1_SW S2_SW S3_SW S4_SW = SW_PB: Manufacturer: TYCO; Part Number: 0-1437565-1; Value: FSM; Currency: CHF; Packaging unit: 1; Prize: 0.86; Distributor Number: 200858; RoHS: yes; Distributor: Distrelec
S5_SW = SW-DIP4: Manufacturer: Diptronics; Part Number: PM-040900; Currency: CHF; Packaging unit: 1; Prize: 3.34; Value: SW-DIP4; Distributor Number: 210036; RoHS: yes; Distributor: Distrelec

## Sheet usb.SCHDOC: USB and FPGA Boot System
size A4; Organization: Berne University of Applied Science; Address1: School of Engineering and; Address2: Information Technology; Address3: Quellgasse 21; Address4: CH-2501 Biel; Revision: 1.0; SheetNumber: 14; SheetTotal: 19; ApprovedBy: zem1; Author: zac1
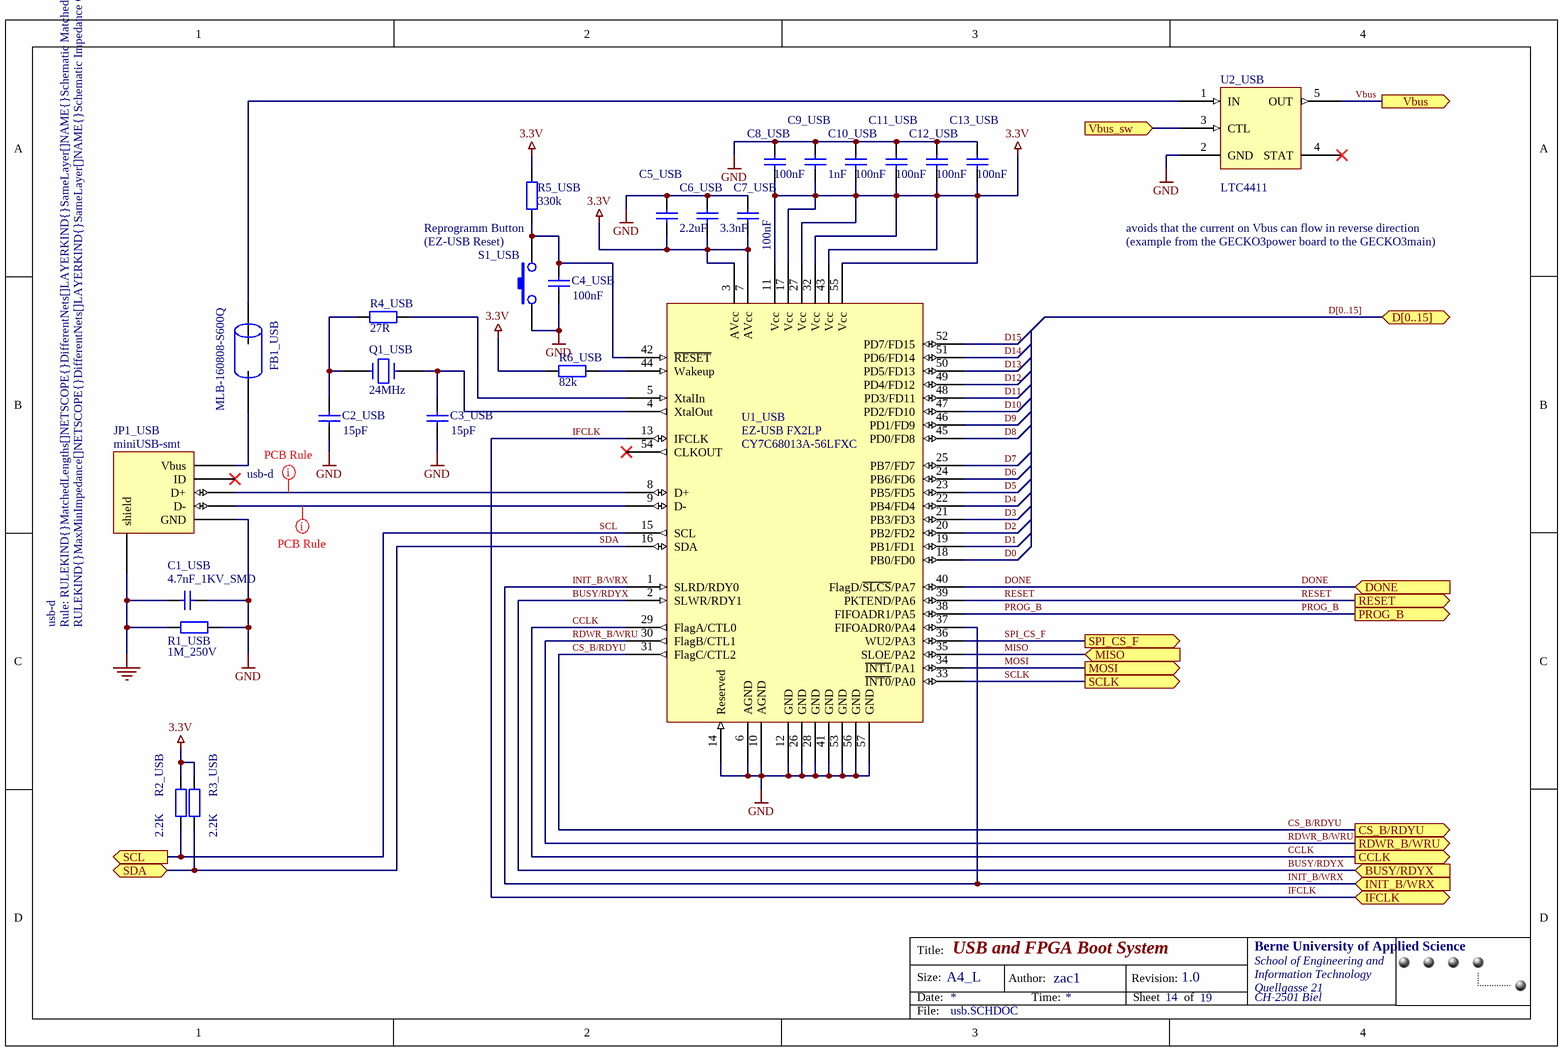
[diagram p13: usb.SCHDOC]

### Parts
C1_USB  value 4.7nF_1KV_SMD  [CC3216-1206]  (hidden comment: C)
C2_USB  value 15pF  [0402]  (hidden comment: C0402)
C3_USB  value 15pF  [0402]  (hidden comment: C0402)
C4_USB  value 100nF  [0402]  (hidden comment: C0402)
C5_USB  value 2.2uF  [0805]  (hidden comment: Cap)
C6_USB  value 3.3nF  [0402]  (hidden comment: Cap)
C7_USB  value 100nF  [0402]  (hidden comment: Cap)
C8_USB  value 100nF  [0402]  (hidden comment: Cap)
C9_USB  value 1nF  [0402]  (hidden comment: Cap)
C10_USB  value 100nF  [0402]  (hidden comment: Cap)
C11_USB  value 100nF  [0402]  (hidden comment: Cap)
C12_USB  value 100nF  [0402]  (hidden comment: Cap)
C13_USB  value 100nF  [0402]  (hidden comment: Cap)
FB1_USB  value MLB-160808-S600Q  [0603]  (hidden comment: FERRITE-BEAD)
JP1_USB  value miniUSB-smt  [USB_MINI_B_SMD]  (hidden comment: USB-MINIB-SMT)
Q1_USB  value 24MHz  [AT49]  (hidden comment: QUARZ-SMD)
R1_USB  value 1M_250V  [CC3216-1206]  (hidden comment: Res2)
R2_USB  value 2.2K  [0402]  (hidden comment: Res2)
R3_USB  value 2.2K  [0402]  (hidden comment: Res2)
R4_USB  value 27R  [0402]  (hidden comment: Res2)
R5_USB  value 330k  [0402]  (hidden comment: Res2)
R6_USB  value 82k  [0402]  (hidden comment: Res2)
S1_USB  Reprogramm Button  [FSM]
U1_USB  EZ-USB FX2LP  value CY7C68013A-56LFXC  [QFN8x8]
U2_USB  LTC4411  [TSOP-23-5]

### Ports
BUSY/RDYX (in), CCLK (out), CS_B/RDYU (out), D[0..15] (bidir), DONE (in), IFCLK (bidir), INIT_B/WRX (in), MISO (in), MOSI (out), PROG_B (out), RDWR_B/WRU (out), RESET (out), SCL (out), SCLK (out), SDA (bidir), SPI_CS_F (out), Vbus (out), Vbus_sw (in)

### Nets
3.3V: C5_USB.1 C6_USB.1 C7_USB.1 C8_USB.1 C9_USB.1 C10_USB.1 C11_USB.1 C12_USB.1 C13_USB.1 R2_USB.2 R3_USB.2 R5_USB.2 R6_USB.2 U1_USB.3(AVcc) U1_USB.7(AVcc) U1_USB.11(Vcc) U1_USB.17(Vcc) U1_USB.27(Vcc) U1_USB.32(Vcc) U1_USB.43(Vcc) U1_USB.55(Vcc)
Earth: C1_USB.1 JP1_USB.shield R1_USB.1
GND: C1_USB.2 C2_USB.1 C3_USB.1 C4_USB.1 C5_USB.2 C6_USB.2 C7_USB.2 C8_USB.2 C9_USB.2 C10_USB.2 C11_USB.2 C12_USB.2 C13_USB.2 JP1_USB.GND R1_USB.2 S1_USB.1 U1_USB.6(AGND) U1_USB.10(AGND) U1_USB.12(GND) U1_USB.14(Reserved) U1_USB.26(GND) U1_USB.28(GND) U1_USB.41(GND) U1_USB.53(GND) U1_USB.56(GND) U1_USB.57(GND) U2_USB.2(GND)
BUSY/RDYX: U1_USB.2(SLWR/RDY1) ; port BUSY/RDYX
CCLK: U1_USB.29(FlagA/CTL0) ; port CCLK
CS_B/RDYU: U1_USB.31(FlagC/CTL2) ; port CS_B/RDYU
D0: U1_USB.18(PB0/FD0)
D1: U1_USB.19(PB1/FD1)
D2: U1_USB.20(PB2/FD2)
D3: U1_USB.21(PB3/FD3)
D4: U1_USB.22(PB4/FD4)
D5: U1_USB.23(PB5/FD5)
D6: U1_USB.24(PB6/FD6)
D7: U1_USB.25(PB7/FD7)
D8: U1_USB.45(PD0/FD8)
D9: U1_USB.46(PD1/FD9)
D10: U1_USB.47(PD2/FD10)
D11: U1_USB.48(PD3/FD11)
D12: U1_USB.49(PD4/FD12)
D13: U1_USB.50(PD5/FD13)
D14: U1_USB.51(PD6/FD14)
D15: U1_USB.52(PD7/FD15)
DONE: U1_USB.40(FlagD/~{SLCS}/PA7) ; port DONE
IFCLK: U1_USB.13(IFCLK) ; port IFCLK
INIT_B/WRX: U1_USB.1(SLRD/RDY0) U1_USB.37(FIFOADR0/PA4) ; port INIT_B/WRX
MISO: U1_USB.35(SLOE/PA2) ; port MISO
MOSI: U1_USB.34(~{INT1}/PA1) ; port MOSI
PROG_B: U1_USB.38(FIFOADR1/PA5) ; port PROG_B
RDWR_B/WRU: U1_USB.30(FlagB/CTL1) ; port RDWR_B/WRU
RESET: U1_USB.39(PKTEND/PA6) ; port RESET
SCL: R2_USB.1 U1_USB.15(SCL) ; port SCL
SCLK: U1_USB.33(~{INT0}/PA0) ; port SCLK
SDA: R3_USB.1 U1_USB.16(SDA) ; port SDA
SPI_CS_F: U1_USB.36(WU2/PA3) ; port SPI_CS_F
Vbus: U2_USB.5(OUT) ; port Vbus
Vbus_sw: U2_USB.3(CTL) ; port Vbus_sw
NetC2_USB_2: C2_USB.2 Q1_USB.1 R4_USB.2
NetC3_USB_2: C3_USB.2 Q1_USB.2 U1_USB.4(XtalOut)
NetC4_USB_2: C4_USB.2 R5_USB.1 S1_USB.2 U1_USB.42(~{RESET})
NetFB1_USB_1: FB1_USB.1 JP1_USB.Vbus
NetFB1_USB_2: FB1_USB.2 U2_USB.1(IN)
NetJP1_USB_D+: JP1_USB.D+ U1_USB.8(D+)
NetJP1_USB_D-: JP1_USB.D- U1_USB.9(D-)
NetR4_USB_1: R4_USB.1 U1_USB.5(XtalIn)
NetR6_USB_1: R6_USB.1 U1_USB.44(Wakeup)

Not connected (* = marked no-connect by the designer): JP1_USB ID*; U1_USB 54(CLKOUT)*; U2_USB 4(STAT)*

### Buses and harness runs
bus D[0..15] = port D[0..15]

### Layout directives
rule Matched Net Lengths [Tolerance = 1mm    Style - 90 Degrees    Amplitude = 5.08mm    Gap = 0.508mm    ]; net class usb-d; rule Impedance Constraint [Min = 79.00    Max = 100.0    ]: NetJP1_USB_D-
net class usb-d: NetJP1_USB_D+

### Notes on the sheet
- (EZ-USB Reset)
- avoids that the current on Vbus can flow in reverse direction
- (example from the GECKO3power board to the GECKO3main)
- Title:
- Size:
- Date:
- A4_L
- Author:
- Time:
- Revision:
- Sheet
- of
- File:

### Library data of the parts
C1_USB = C: Manufacturer: AVX; Part Number: 1206AC472KAT1A; Currency: CHF; Packaging unit: 5; Prize: 0.38; Distributor Number: 1216 464; RoHS: yes; Distributor: Farnell
C2_USB C3_USB = C0402: Ceramic Chip Capacitor - Standard; Manufacturer: AVX; Part Number: 04025A150JAT2A; Note: Footprint corresponds to dimensions for bulk cassette packaging. This case size has tightened tolerances.; Currency: CHF; Packaging unit: 1; Prize: 0.07; Published: 17-Jul-2002; LatestRevisionNote: Silkscreen size reduced.; PackageDocument: Mar-2001; PackageReference: 0402; Publisher: Altium Limited; Code_JEITA: 0402; Code_IPC: 1005 [0402]; Distributor Number: 1327 631; RoHS: yes; Distributor: Farnell
C4_USB = C0402: Ceramic Chip Capacitor - Standard; Manufacturer: Murata; Part Number: GRM155R71C104KA88D; Note: Footprint corresponds to dimensions for bulk cassette packaging. This case size has tightened tolerances.; Currency: CHF; Packaging unit: 10; Prize: 0.07; Published: 17-Jul-2002; LatestRevisionNote: Silkscreen size reduced.; PackageDocument: Mar-2001; PackageReference: 0402; Publisher: Altium Limited; Code_JEITA: 0402; Code_IPC: 1005 [0402]; Distributor Number: 8819 742; RoHS: yes; Distributor: Farnell
C5_USB = Cap: Capacitor; Manufacturer: Murata; Part Number: GRM21BR71A225KA01L; Class I: Passive; Currency: CHF; Packaging unit: 1; Prize: 0.54; Published: 8-Jun-2000; Revision: July-2002: Re-released for DXP Platform.; Publisher: Altium Limited; Class II: Capacitor; Distributor Number: 823 517; RoHS: yes; Distributor: Distrelec
C6_USB = Cap: Capacitor; Manufacturer: PHYCOMP; Part Number: 2238 587 15629; Class I: Passive; Currency: CHF; Packaging unit: 10; Prize: 0.11; Published: 8-Jun-2000; Revision: July-2002: Re-released for DXP Platform.; Publisher: Altium Limited; Class II: Capacitor; Distributor Number: 3019 410; RoHS: yes; Distributor: Farnell
C7_USB C8_USB C10_USB C11_USB C12_USB C13_USB = Cap: Capacitor; Manufacturer: Murata; Part Number: GRM155R71C104KA88D; Class I: Passive; Currency: CHF; Packaging unit: 10; Prize: 0.07; Published: 8-Jun-2000; Revision: July-2002: Re-released for DXP Platform.; Publisher: Altium Limited; Class II: Capacitor; Distributor Number: 8819 742; RoHS: yes; Distributor: Farnell
C9_USB = Cap: Capacitor; Manufacturer: PHYCOMP; Part Number: 2238 587 15623; Class I: Passive; Currency: CHF; Packaging unit: 10; Prize: 0.11; Published: 8-Jun-2000; Revision: July-2002: Re-released for DXP Platform.; Publisher: Altium Limited; Class II: Capacitor; Distributor Number: 3019 380; RoHS: yes; Distributor: Farnell
FB1_USB = FERRITE-BEAD: Manufacturer: Kitagawa; Currency: CHF; Packaging unit: 5; Prize: 0.75; Distributor Number: 330131; Part Number: MLB-160808-S600Q; RoHS: yes; Distributor: Distrelec
JP1_USB = USB-MINIB-SMT: Manufacturer: Lumberg; Part Number: 2486 01; Currency: CHF; Packaging unit: 1; Prize: 2.55; Distributor Number: 1243 250; RoHS: yes; Distributor: Farnell
Q1_USB = QUARZ-SMD: SMD Quarz in the AT49 Case, like the ABLS series from Abracon; Manufacturer: auris; Part Number: Q-24.000M-HC49USSMD-F-30-50-D-30; Currency: CHF; Packaging unit: 1; Prize: 1.29; Distributor Number: 335040; RoHS: yes; Distributor: Distrelec
R1_USB = Res2: Resistor; Manufacturer: Multicomp; Part Number: MC 0.125W 1206 1% 1M; Class I: Passive; Currency: CHF; Packaging unit: 50; Prize: 0.055; Published: 8-Jun-2000; Revision: July-2002: Re-released for DXP Platform.; Publisher: Altium Limited; Class II: Resistor; Distributor Number: 9335781; RoHS: X-yes; Distributor: Farnell
R2_USB R3_USB = Res2: Resistor; Manufacturer: PHYCOMP; Part Number: 232270672202; Class I: Passive; Currency: CHF; Packaging unit: 50; Prize: 0.12; Published: 8-Jun-2000; Revision: July-2002: Re-released for DXP Platform.; Publisher: Altium Limited; Class II: Resistor; Distributor Number: 9239278; RoHS: yes; Distributor: Farnell
R4_USB = Res2: Resistor; Manufacturer: PHYCOMP; Part Number: 232270672709; Class I: Passive; Currency: CHF; Packaging unit: 50; Prize: 0.12; Published: 8-Jun-2000; Revision: July-2002: Re-released for DXP Platform.; Publisher: Altium Limited; Class II: Resistor; Distributor Number: 9239049; RoHS: yes; Distributor: Farnell
R5_USB = Res2: Resistor; Manufacturer: PHYCOMP; Part Number: 232270673304; Class I: Passive; Currency: CHF; Packaging unit: 50; Prize: 0.12; Published: 8-Jun-2000; Revision: July-2002: Re-released for DXP Platform.; Publisher: Altium Limited; Class II: Resistor; Distributor Number: 9239537; RoHS: yes; Distributor: Farnell
R6_USB = Res2: Resistor; Manufacturer: PHYCOMP; Part Number: 232270678203; Class I: Passive; Currency: CHF; Packaging unit: 50; Prize: 0.12; Published: 8-Jun-2000; Revision: July-2002: Re-released for DXP Platform.; Publisher: Altium Limited; Class II: Resistor; Distributor Number: 9239464; RoHS: yes; Distributor: Farnell
S1_USB = SW_PB: Manufacturer: TYCO; Part Number: 0-1437565-1; Value: FSM; Currency: CHF; Packaging unit: 1; Prize: 0.86; Distributor Number: 200858; RoHS: yes; Distributor: Distrelec
U1_USB = EZ-USB-FX2_QFN: Manufacturer: Cypress; Currency: CHF; lead time: 5 Weeks; Packaging unit: 260; Prize: 12.39; Distributor Number: CY7C68013A56LFXC; Part Number: CY7C68013A-56LFXC; RoHS: yes; Distributor: Silica
U2_USB = LTC4411: Manufacturer: Linear; Part Number: LTC4411ES5#PBF; Currency: $; Packaging unit: 1; Prize: 2.36; lead time: 2 Weeks; Value: LTC4411; Distributor Number: LTC4411ES5#PBF; RoHS: yes; Distributor: Linear online

## Sheet flash.SchDoc: NOR Flash
size A3; Organization: Berne University of Applied Science; Address1: School of Engineering and; Address2: Information Technology; Address3: Quellgasse 21; Address4: CH-2501 Biel; Revision: 1.0; SheetNumber: 11; SheetTotal: 19; ApprovedBy: zem1; Author: zac1
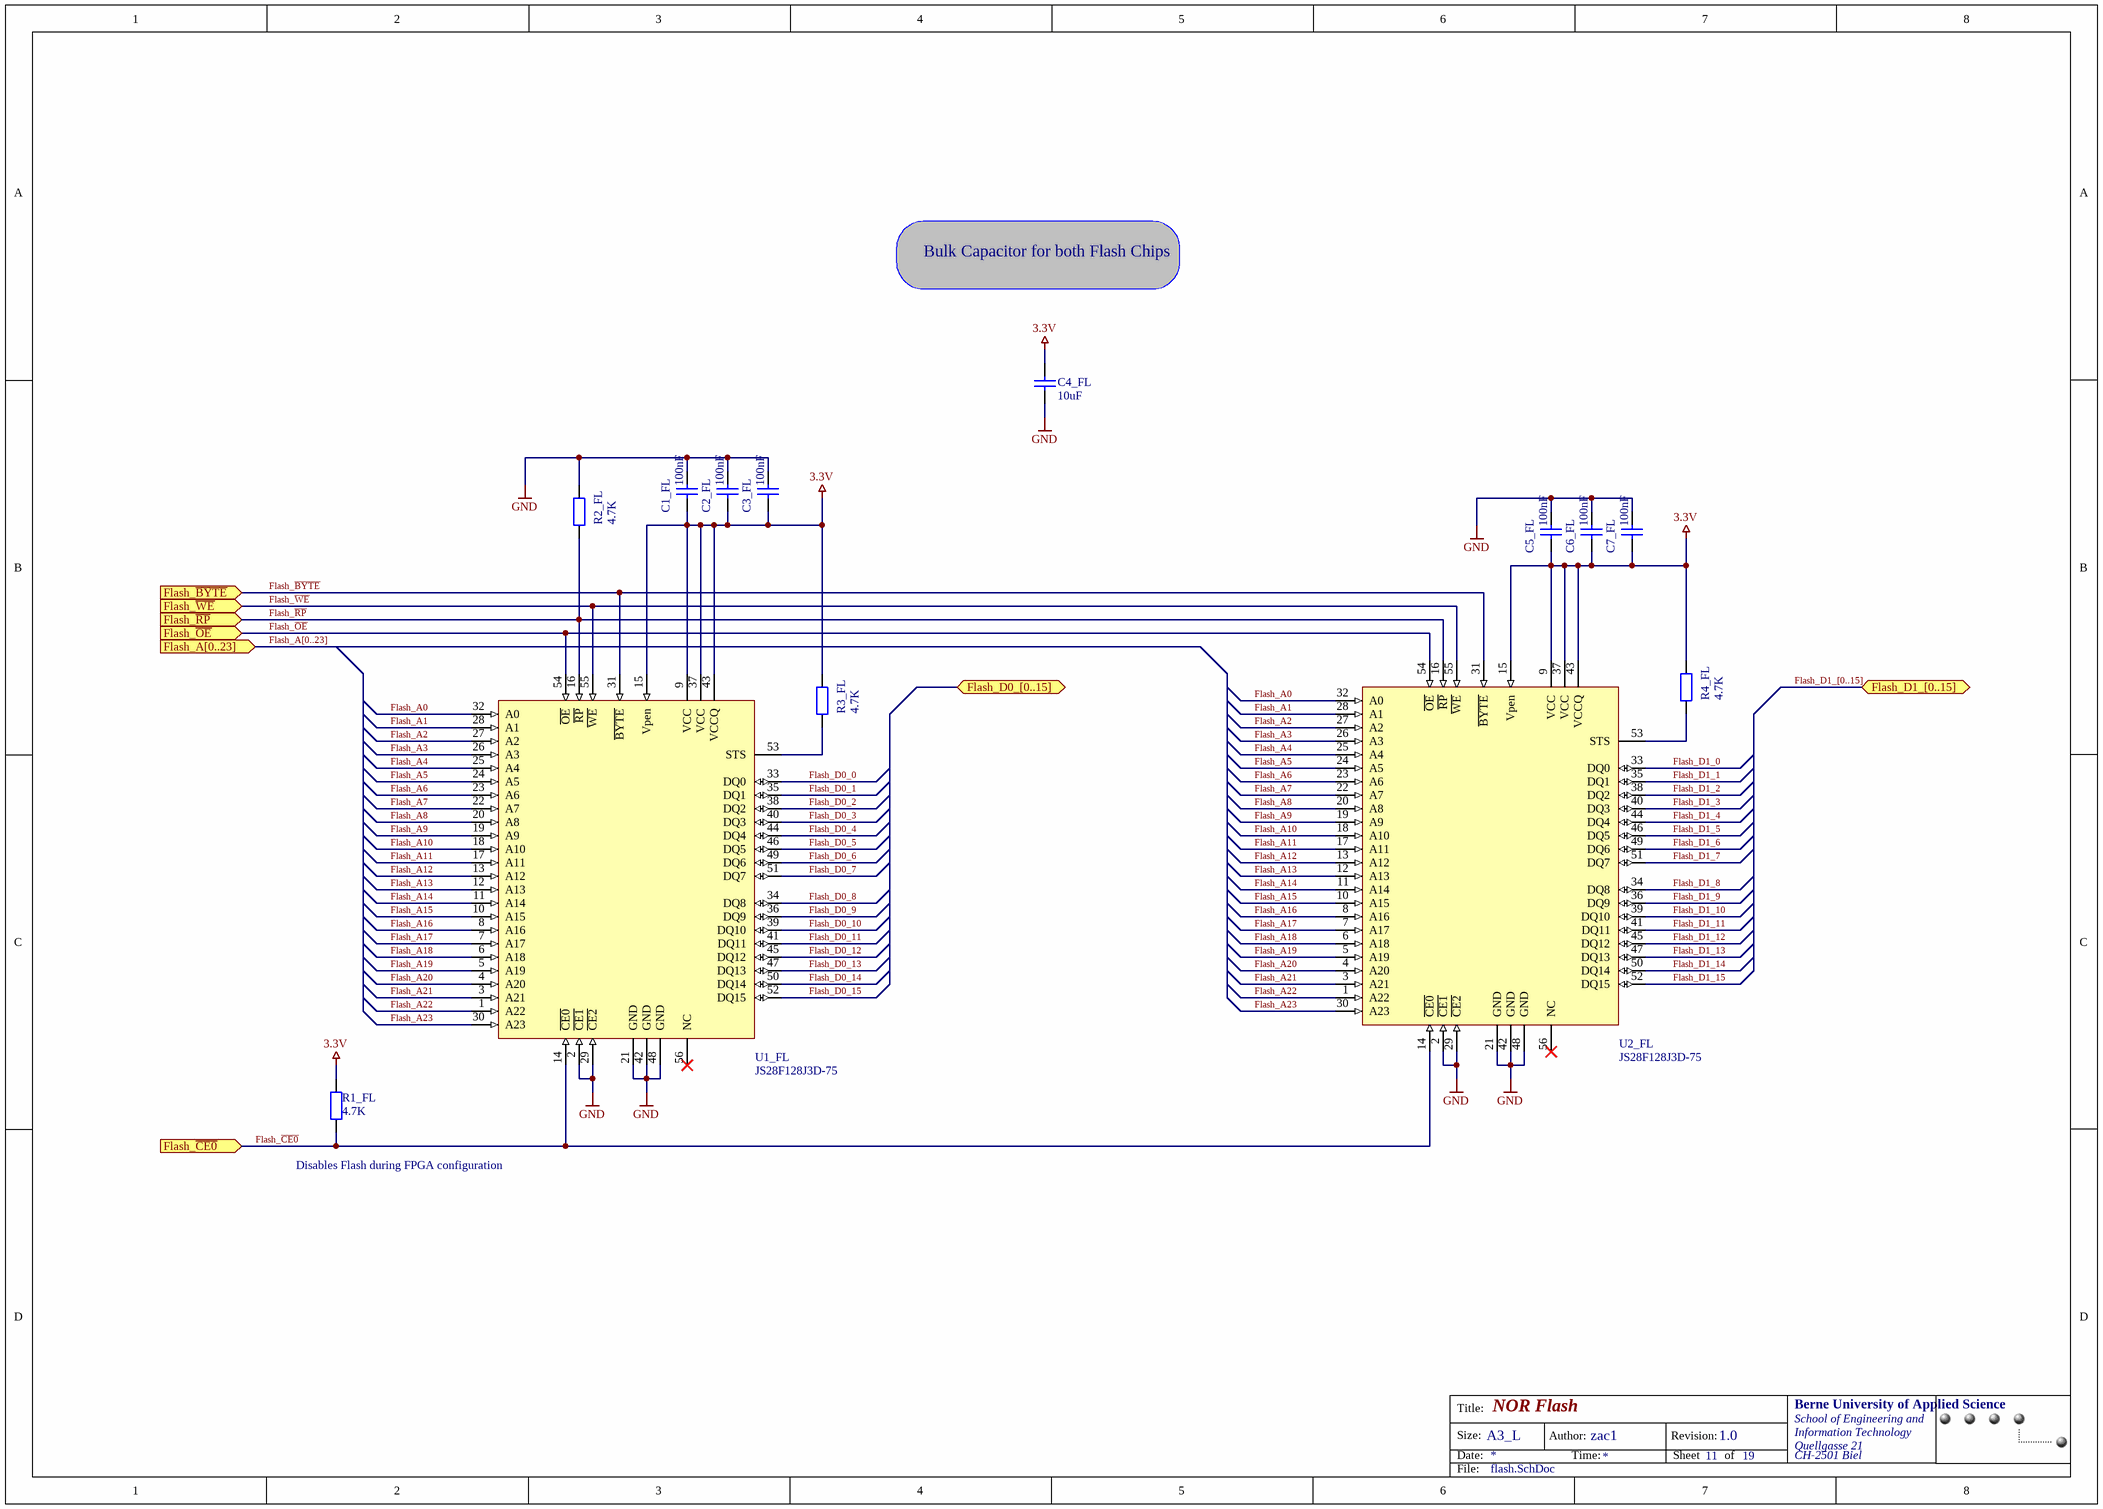
[diagram p14: flash.SchDoc]

### Parts
C1_FL  value 100nF  [0402]  (hidden comment: Cap)
C2_FL  value 100nF  [0402]  (hidden comment: Cap)
C3_FL  value 100nF  [0402]  (hidden comment: Cap)
C4_FL  value 10uF  [1206]  (hidden comment: Cap)
C5_FL  value 100nF  [0402]  (hidden comment: Cap)
C6_FL  value 100nF  [0402]  (hidden comment: Cap)
C7_FL  value 100nF  [0402]  (hidden comment: Cap)
R1_FL  value 4.7K  [0402]  (hidden comment: Res2)
R2_FL  value 4.7K  [0402]  (hidden comment: Res2)
R3_FL  value 4.7K  [0402]  (hidden comment: Res2)
R4_FL  value 4.7K  [0402]  (hidden comment: Res2)
U1_FL  value JS28F128J3D-75  [TSSO14X20-G56]  (hidden comment: JS28FXXXJ3D-75)
U2_FL  value JS28F128J3D-75  [TSSO14X20-G56]  (hidden comment: JS28FXXXJ3D-75)

### Ports
Flash_A[0..23] (in), Flash_D0_[0..15] (bidir), Flash_D1_[0..15] (bidir), Flash_~{BYTE} (in), Flash_~{CE0} (in), Flash_~{OE} (in), Flash_~{RP} (in), Flash_~{WE} (in)

### Nets
3.3V: C1_FL.2 C2_FL.2 C3_FL.2 C4_FL.2 C5_FL.2 C6_FL.2 C7_FL.2 R1_FL.1 R3_FL.2 R4_FL.2 U1_FL.9(VCC) U1_FL.15(Vpen) U1_FL.37(VCC) U1_FL.43(VCCQ) U2_FL.9(VCC) U2_FL.15(Vpen) U2_FL.37(VCC) U2_FL.43(VCCQ)
GND: C1_FL.1 C2_FL.1 C3_FL.1 C4_FL.1 C5_FL.1 C6_FL.1 C7_FL.1 R2_FL.2 U1_FL.2(~{CE1}) U1_FL.21(GND) U1_FL.29(~{CE2}) U1_FL.42(GND) U1_FL.48(GND) U2_FL.2(~{CE1}) U2_FL.21(GND) U2_FL.29(~{CE2}) U2_FL.42(GND) U2_FL.48(GND)
FLASH_A0: U1_FL.32(A0) U2_FL.32(A0)
FLASH_A1: U1_FL.28(A1) U2_FL.28(A1)
FLASH_A2: U1_FL.27(A2) U2_FL.27(A2)
FLASH_A3: U1_FL.26(A3) U2_FL.26(A3)
FLASH_A4: U1_FL.25(A4) U2_FL.25(A4)
FLASH_A5: U1_FL.24(A5) U2_FL.24(A5)
FLASH_A6: U1_FL.23(A6) U2_FL.23(A6)
FLASH_A7: U1_FL.22(A7) U2_FL.22(A7)
FLASH_A8: U1_FL.20(A8) U2_FL.20(A8)
FLASH_A9: U1_FL.19(A9) U2_FL.19(A9)
FLASH_A10: U1_FL.18(A10) U2_FL.18(A10)
FLASH_A11: U1_FL.17(A11) U2_FL.17(A11)
FLASH_A12: U1_FL.13(A12) U2_FL.13(A12)
FLASH_A13: U1_FL.12(A13) U2_FL.12(A13)
FLASH_A14: U1_FL.11(A14) U2_FL.11(A14)
FLASH_A15: U1_FL.10(A15) U2_FL.10(A15)
FLASH_A16: U1_FL.8(A16) U2_FL.8(A16)
FLASH_A17: U1_FL.7(A17) U2_FL.7(A17)
FLASH_A18: U1_FL.6(A18) U2_FL.6(A18)
FLASH_A19: U1_FL.5(A19) U2_FL.5(A19)
FLASH_A20: U1_FL.4(A20) U2_FL.4(A20)
FLASH_A21: U1_FL.3(A21) U2_FL.3(A21)
FLASH_A22: U1_FL.1(A22) U2_FL.1(A22)
FLASH_A23: U1_FL.30(A23) U2_FL.30(A23)
FLASH_~{BYTE}: U1_FL.31(~{BYTE}) U2_FL.31(~{BYTE}) ; port Flash_~{BYTE}
FLASH_~{CE0}: R1_FL.2 U1_FL.14(~{CE0}) U2_FL.14(~{CE0}) ; port Flash_~{CE0}
FLASH_D0_0: U1_FL.33(DQ0)
FLASH_D0_1: U1_FL.35(DQ1)
FLASH_D0_2: U1_FL.38(DQ2)
FLASH_D0_3: U1_FL.40(DQ3)
FLASH_D0_4: U1_FL.44(DQ4)
FLASH_D0_5: U1_FL.46(DQ5)
FLASH_D0_6: U1_FL.49(DQ6)
FLASH_D0_7: U1_FL.51(DQ7)
FLASH_D0_8: U1_FL.34(DQ8)
FLASH_D0_9: U1_FL.36(DQ9)
FLASH_D0_10: U1_FL.39(DQ10)
FLASH_D0_11: U1_FL.41(DQ11)
FLASH_D0_12: U1_FL.45(DQ12)
FLASH_D0_13: U1_FL.47(DQ13)
FLASH_D0_14: U1_FL.50(DQ14)
FLASH_D0_15: U1_FL.52(DQ15)
FLASH_D1_0: U2_FL.33(DQ0)
FLASH_D1_1: U2_FL.35(DQ1)
FLASH_D1_2: U2_FL.38(DQ2)
FLASH_D1_3: U2_FL.40(DQ3)
FLASH_D1_4: U2_FL.44(DQ4)
FLASH_D1_5: U2_FL.46(DQ5)
FLASH_D1_6: U2_FL.49(DQ6)
FLASH_D1_7: U2_FL.51(DQ7)
FLASH_D1_8: U2_FL.34(DQ8)
FLASH_D1_9: U2_FL.36(DQ9)
FLASH_D1_10: U2_FL.39(DQ10)
FLASH_D1_11: U2_FL.41(DQ11)
FLASH_D1_12: U2_FL.45(DQ12)
FLASH_D1_13: U2_FL.47(DQ13)
FLASH_D1_14: U2_FL.50(DQ14)
FLASH_D1_15: U2_FL.52(DQ15)
FLASH_~{OE}: U1_FL.54(~{OE}) U2_FL.54(~{OE}) ; port Flash_~{OE}
FLASH_~{RP}: R2_FL.1 U1_FL.16(~{RP}) U2_FL.16(~{RP}) ; port Flash_~{RP}
FLASH_~{WE}: U1_FL.55(~{WE}) U2_FL.55(~{WE}) ; port Flash_~{WE}
NetR3_FL_1: R3_FL.1 U1_FL.53(STS)
NetR4_FL_1: R4_FL.1 U2_FL.53(STS)

Not connected (* = marked no-connect by the designer): U1_FL 56(NC)*; U2_FL 56(NC)*

### Buses and harness runs
bus Flash_A[0..23] = port Flash_A[0..23]
bus Flash_D1_[0..15] = port Flash_D1_[0..15]

### Notes on the sheet
- Bulk Capacitor for both Flash Chips
- (near R1_FL) Disables Flash during FPGA configuration
- Title:
- Size:
- Date:
- A3_L
- Author:
- Time:
- Revision:
- Sheet
- of
- File:

### Library data of the parts
C1_FL C2_FL C3_FL C5_FL C6_FL C7_FL = Cap: as C7_USB on sheet usb; Published: 8-Jun-2000; Revision: July-2002: Re-released for DXP Platform.; Publisher: Altium Limited; Class II: Capacitor; Distributor Number: 8819 742; RoHS: yes; Distributor: Farnell
C4_FL = Cap: Capacitor; Manufacturer: Murata; Part Number: GRM31CR70J106KA01L; Class I: Passive; Currency: CHF; Packaging unit: 1; Prize: 0.25; Published: 8-Jun-2000; Revision: July-2002: Re-released for DXP Platform.; Publisher: Altium Limited; Class II: Capacitor; Distributor Number: 9527 729; RoHS: yes; Distributor: Farnell
R1_FL R2_FL R3_FL R4_FL = Res2: Resistor; Manufacturer: PHYCOMP; Part Number: 232270674702; Class I: Passive; Currency: CHF; Packaging unit: 50; Prize: 0.12; Published: 8-Jun-2000; Revision: July-2002: Re-released for DXP Platform.; Publisher: Altium Limited; Class II: Resistor; Distributor Number: 9239316; RoHS: yes; Distributor: Farnell
U1_FL U2_FL = JS28FXXXJ3D-75: Intel embedded Flash J3; Currency: $; Packaging unit: 96; Prize: 10.2; lead time: 13 Weeks; Distributor Number: JS28F128J3D-75; Manufacturer: Intel; Part Number: JS28F128J3D-75; RoHS: yes; Distributor: Silica

## Sheet dram1.SCHDOC: First DDR SDRAM
size A3; Organization: Berne University of Applied Science; Address1: School of Engineering and; Address2: Information Technology; Address3: Quellgasse 21; Address4: CH-2501 Biel; Revision: 1.0; SheetNumber: 9; SheetTotal: 19; ApprovedBy: zem1; Author: zac1
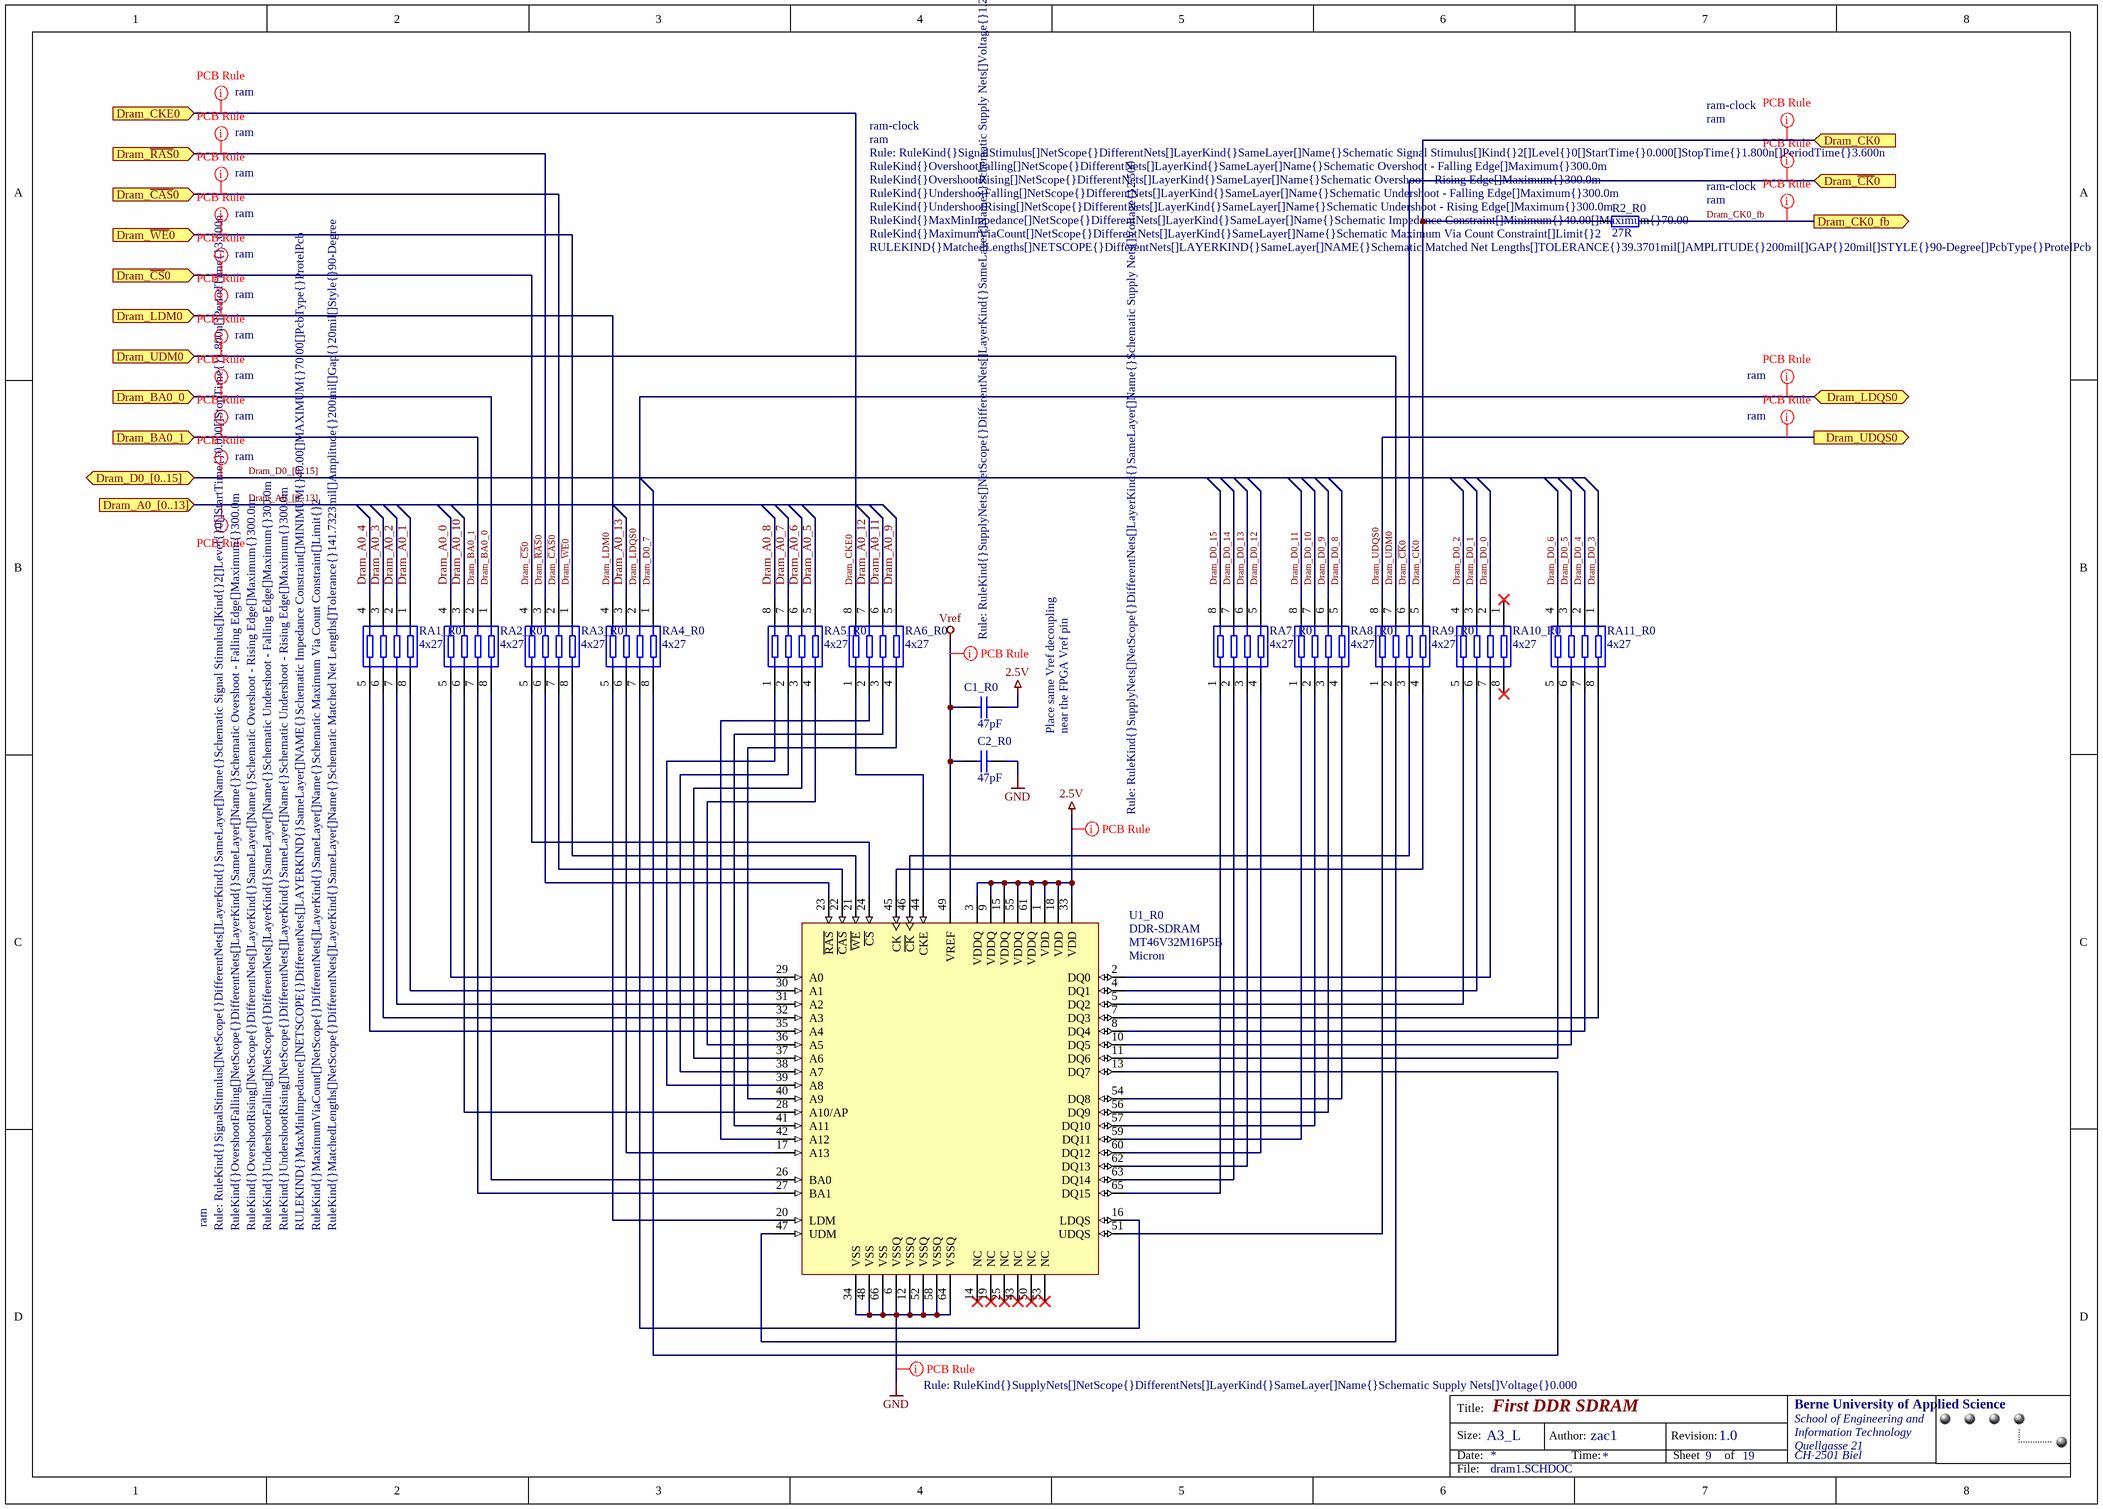
[diagram p15: dram1.SCHDOC]

### Parts
C1_R0  value 47pF  [0402]  (hidden comment: Cap)
C2_R0  value 47pF  [0402]  (hidden comment: Cap)
R2_R0  value 27R  [0402]  (hidden comment: Res2)
RA1_R0  value 4x27  [1206_ARRAY]
RA2_R0  value 4x27  [1206_ARRAY]
RA3_R0  value 4x27  [1206_ARRAY]
RA4_R0  value 4x27  [1206_ARRAY]
RA5_R0  value 4x27  [1206_ARRAY]
RA6_R0  value 4x27  [1206_ARRAY]
RA7_R0  value 4x27  [1206_ARRAY]
RA8_R0  value 4x27  [1206_ARRAY]
RA9_R0  value 4x27  [1206_ARRAY]
RA10_R0  value 4x27  [1206_ARRAY]
RA11_R0  value 4x27  [1206_ARRAY]
U1_R0  DDR-SDRAM  value MT46V32M16P5B  vendor: Micron  [TSOP66]

### Ports
Dram_A0_[0..13] (in), Dram_BA0_0 (in), Dram_BA0_1 (in), Dram_CK0 (in), Dram_CK0_fb (out), Dram_CKE0 (in), Dram_D0_[0..15] (bidir), Dram_LDM0 (in), Dram_LDQS0 (bidir), Dram_UDM0 (in), Dram_UDQS0 (out), Dram_~{CAS}0 (in), Dram_~{CK}0 (in), Dram_~{CS}0 (in), Dram_~{RAS}0 (in), Dram_~{WE}0 (in)

### Nets
2.5V: C1_R0.1 U1_R0.1(VDD) U1_R0.3(VDDQ) U1_R0.9(VDDQ) U1_R0.15(VDDQ) U1_R0.18(VDD) U1_R0.33(VDD) U1_R0.55(VDDQ) U1_R0.61(VDDQ)
GND: C2_R0.1 U1_R0.6(VSSQ) U1_R0.12(VSSQ) U1_R0.34(VSS) U1_R0.48(VSS) U1_R0.52(VSSQ) U1_R0.58(VSSQ) U1_R0.64(VSSQ) U1_R0.66(VSS)
Vref: C1_R0.2 C2_R0.2 U1_R0.49(VREF)
DRAM_A0_0: RA2_R0.4
DRAM_A0_1: RA1_R0.1
DRAM_A0_2: RA1_R0.2
DRAM_A0_3: RA1_R0.3
DRAM_A0_4: RA1_R0.4
Dram_A0_5: RA5_R0.5
Dram_A0_6: RA5_R0.6
DRAM_A0_7: RA5_R0.7
Dram_A0_8: RA5_R0.8
Dram_A0_9: RA6_R0.5
DRAM_A0_10: RA2_R0.3
DRAM_A0_11: RA6_R0.6
DRAM_A0_12: RA6_R0.7
DRAM_A0_13: RA4_R0.3
DRAM_BA0_0: RA2_R0.1 ; port Dram_BA0_0
DRAM_BA0_1: RA2_R0.2 ; port Dram_BA0_1
DRAM_~{CAS}0: RA3_R0.2 ; port Dram_~{CAS}0
DRAM_~{CK}0: RA9_R0.6 ; port Dram_~{CK}0
DRAM_~{CS}0: RA3_R0.4 ; port Dram_~{CS}0
DRAM_CK0: R2_R0.2 RA9_R0.5 ; port Dram_CK0
Dram_CK0_fb: R2_R0.1 ; port Dram_CK0_fb
DRAM_CKE0: RA6_R0.8 ; port Dram_CKE0
DRAM_D0_0: RA10_R0.2
DRAM_D0_1: RA10_R0.3
DRAM_D0_2: RA10_R0.4
DRAM_D0_3: RA11_R0.1
DRAM_D0_4: RA11_R0.2
DRAM_D0_5: RA11_R0.3
DRAM_D0_6: RA11_R0.4
DRAM_D0_7: RA4_R0.1
DRAM_D0_8: RA8_R0.5
DRAM_D0_9: RA8_R0.6
DRAM_D0_10: RA8_R0.7
DRAM_D0_11: RA8_R0.8
DRAM_D0_12: RA7_R0.5
DRAM_D0_13: RA7_R0.6
DRAM_D0_14: RA7_R0.7
DRAM_D0_15: RA7_R0.8
DRAM_LDM0: RA4_R0.4 ; port Dram_LDM0
DRAM_LDQS0: RA4_R0.2 ; port Dram_LDQS0
DRAM_~{RAS}0: RA3_R0.3 ; port Dram_~{RAS}0
DRAM_UDM0: RA9_R0.7 ; port Dram_UDM0
DRAM_UDQS0: RA9_R0.8 ; port Dram_UDQS0
DRAM_~{WE}0: RA3_R0.1 ; port Dram_~{WE}0
NetRA1_R0_5: RA1_R0.5 U1_R0.35(A4)
NetRA1_R0_6: RA1_R0.6 U1_R0.32(A3)
NetRA1_R0_7: RA1_R0.7 U1_R0.31(A2)
NetRA1_R0_8: RA1_R0.8 U1_R0.30(A1)
NetRA2_R0_5: RA2_R0.5 U1_R0.29(A0)
NetRA2_R0_6: RA2_R0.6 U1_R0.28(A10/AP)
NetRA2_R0_7: RA2_R0.7 U1_R0.27(BA1)
NetRA2_R0_8: RA2_R0.8 U1_R0.26(BA0)
NetRA3_R0_5: RA3_R0.5 U1_R0.24(~{CS})
NetRA3_R0_6: RA3_R0.6 U1_R0.23(~{RAS})
NetRA3_R0_7: RA3_R0.7 U1_R0.22(~{CAS})
NetRA3_R0_8: RA3_R0.8 U1_R0.21(~{WE})
NetRA4_R0_5: RA4_R0.5 U1_R0.20(LDM)
NetRA4_R0_6: RA4_R0.6 U1_R0.17(A13)
NetRA4_R0_7: RA4_R0.7 U1_R0.16(LDQS)
NetRA4_R0_8: RA4_R0.8 U1_R0.13(DQ7)
NetRA5_R0_1: RA5_R0.1 U1_R0.39(A8)
NetRA5_R0_2: RA5_R0.2 U1_R0.38(A7)
NetRA5_R0_3: RA5_R0.3 U1_R0.37(A6)
NetRA5_R0_4: RA5_R0.4 U1_R0.36(A5)
NetRA6_R0_1: RA6_R0.1 U1_R0.44(CKE)
NetRA6_R0_2: RA6_R0.2 U1_R0.42(A12)
NetRA6_R0_3: RA6_R0.3 U1_R0.41(A11)
NetRA6_R0_4: RA6_R0.4 U1_R0.40(A9)
NetRA7_R0_1: RA7_R0.1 U1_R0.65(DQ15)
NetRA7_R0_2: RA7_R0.2 U1_R0.63(DQ14)
NetRA7_R0_3: RA7_R0.3 U1_R0.62(DQ13)
NetRA7_R0_4: RA7_R0.4 U1_R0.60(DQ12)
NetRA8_R0_1: RA8_R0.1 U1_R0.59(DQ11)
NetRA8_R0_2: RA8_R0.2 U1_R0.57(DQ10)
NetRA8_R0_3: RA8_R0.3 U1_R0.56(DQ9)
NetRA8_R0_4: RA8_R0.4 U1_R0.54(DQ8)
NetRA9_R0_1: RA9_R0.1 U1_R0.51(UDQS)
NetRA9_R0_2: RA9_R0.2 U1_R0.47(UDM)
NetRA9_R0_3: RA9_R0.3 U1_R0.46(~{CK})
NetRA9_R0_4: RA9_R0.4 U1_R0.45(CK)
NetRA10_R0_5: RA10_R0.5 U1_R0.5(DQ2)
NetRA10_R0_6: RA10_R0.6 U1_R0.4(DQ1)
NetRA10_R0_7: RA10_R0.7 U1_R0.2(DQ0)
NetRA11_R0_5: RA11_R0.5 U1_R0.11(DQ6)
NetRA11_R0_6: RA11_R0.6 U1_R0.10(DQ5)
NetRA11_R0_7: RA11_R0.7 U1_R0.8(DQ4)
NetRA11_R0_8: RA11_R0.8 U1_R0.7(DQ3)

Not connected (* = marked no-connect by the designer): RA10_R0 1* 8*; U1_R0 14(NC)* 19(NC)* 25(NC)* 43(NC)* 50(NC)* 53(NC)*

### Buses and harness runs
bus Dram_A0_[0..13] = port Dram_A0_[0..13]
bus Dram_D0_[0..15] = port Dram_D0_[0..15]

### Layout directives
rule Supply Nets [Voltage =  2.500]: 2.5V
rule Supply Nets [Voltage =  1.250]: Vref
rule Supply Nets [Voltage =  0.000]: GND
rule Signal Stimulus [Kind - Periodic Pulse    Level - Low    Start Time =  0.000    Stop Time =  1.800n    Period Time =  3.600n]; rule Overshoot - Falling Edge [Max =  300.0m]; rule Overshoot - Rising Edge [Max =  300.0m]; rule Undershoot - Falling Edge [Max =  300.0m]; rule Undershoot - Rising Edge [Max =  300.0m]; rule Impedance Constraint [Min = 40.00    Max = 70.00    ]; rule Maximum Via Count Constraint [Max Count = 2]; rule Matched Net Lengths [Tolerance = 3.6mm    Style - 90 Degrees    Amplitude = 5.08mm    Gap = 0.508mm    ]; net class ram: (no net found under the mark)
rule Signal Stimulus [Kind - Periodic Pulse    Level - Low    Start Time =  0.000    Stop Time =  1.800n    Period Time =  3.600n]; rule Overshoot - Falling Edge [Max =  300.0m]; rule Overshoot - Rising Edge [Max =  300.0m]; rule Undershoot - Falling Edge [Max =  300.0m]; rule Undershoot - Rising Edge [Max =  300.0m]; rule Impedance Constraint [Min =  40.00    Max =  70.00    ]; rule Maximum Via Count Constraint [Max Count = 2]; rule Matched Net Lengths [Tolerance = 1mm    Style - 90 Degrees    Amplitude = 5.08mm    Gap = 0.508mm    ]; net class ram-clock; net class ram: DRAM_~{CK}0
net class ram-clock; net class ram: DRAM_CK0, Dram_CK0_fb
net class ram: (no net found under the mark), DRAM_BA0_0, DRAM_BA0_1, DRAM_CKE0, DRAM_LDM0, DRAM_LDQS0, DRAM_UDM0, DRAM_UDQS0, DRAM_~{CAS}0, DRAM_~{CS}0, DRAM_~{RAS}0, DRAM_~{WE}0

### Notes on the sheet
- Place same Vref decoupling
- near the FPGA Vref pin
- Title:
- Size:
- Date:
- A3_L
- Author:
- Time:
- Revision:
- Sheet
- of
- File:

### Library data of the parts
C1_R0 C2_R0 = Cap: Capacitor; Manufacturer: Murata; Part Number: GRM1555C1H470JZ01D; Class I: Passive; Currency: CHF; Packaging unit: 10; Prize: 0.07; Published: 8-Jun-2000; Revision: July-2002: Re-released for DXP Platform.; Publisher: Altium Limited; Class II: Capacitor; Distributor Number: 8819 670; RoHS: yes; Distributor: Farnell
R2_R0 = Res2: as R4_USB on sheet usb; Published: 8-Jun-2000; Revision: July-2002: Re-released for DXP Platform.; Publisher: Altium Limited; Class II: Resistor; Distributor Number: 9239049; RoHS: yes; Distributor: Farnell
RA1_R0 RA2_R0 RA3_R0 RA4_R0 RA5_R0 RA6_R0 RA7_R0 RA8_R0 RA9_R0 RA10_R0 RA11_R0 = R_ARRAY_4_SMD: Manufacturer: PHYCOMP; Part Number: 235003410279; Currency: CHF; Packaging unit: 10; Prize: 0.17; Distributor Number: 9234969; RoHS: yes; Distributor: Farnell
U1_R0 = DDR-SDRAM: general model for ddr sdram's; Currency: CHF; lead time: 12 Weeks; Packaging unit: 108; Prize: 15.87; Distributor Number: MT46V32M16P5B; Manufacturer: Micron; Part Number: MT46V32M16P5B; RoHS: yes; Distributor: Silica